# EAGLE design blinds_v60 (EAGLE 7.7.0)

## Sheet 1 of 5
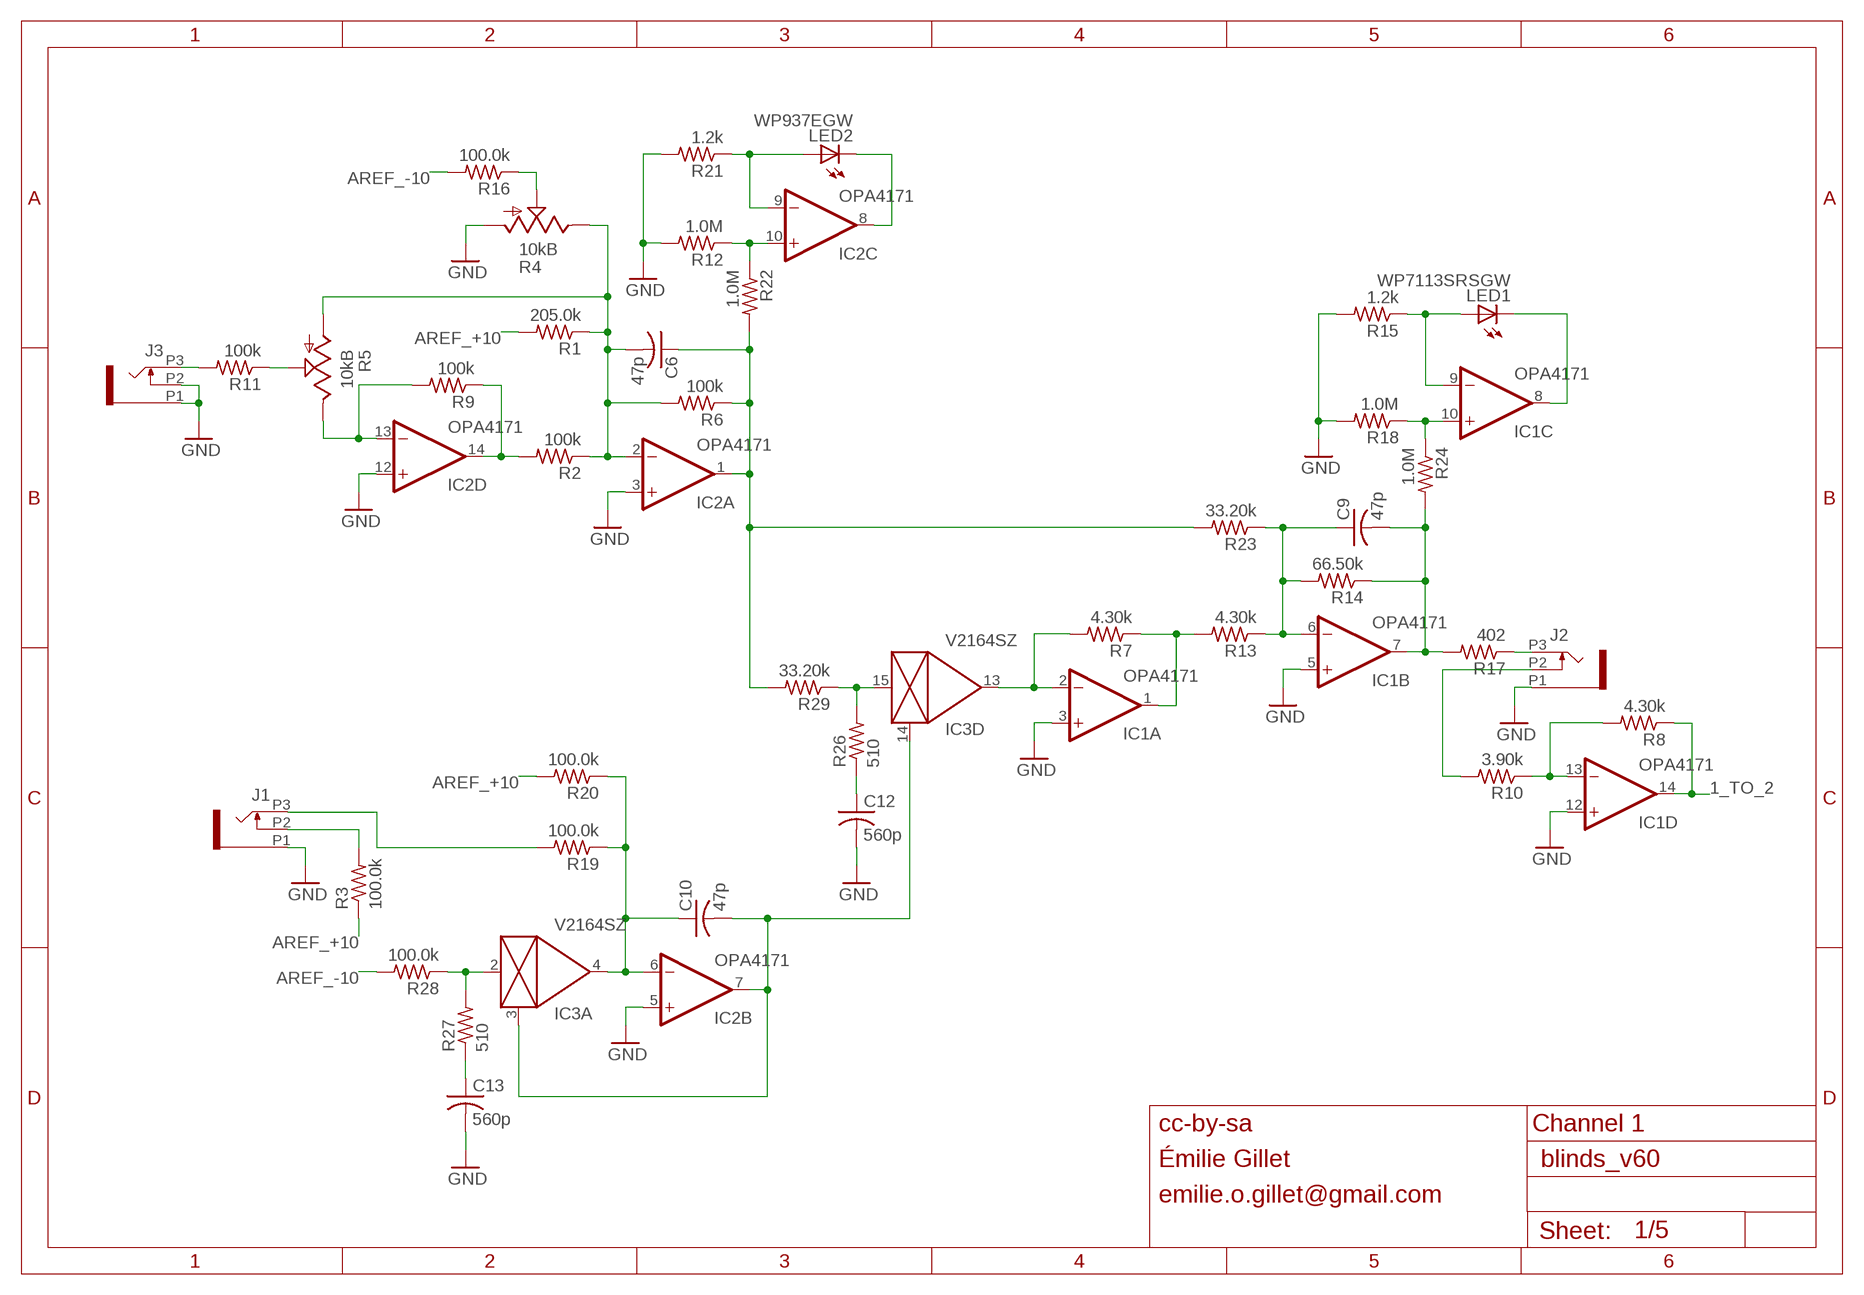
[diagram p0: schematic, sheet 1]

### Parts
C6  47p  C-USC0603  [C0603]
C9  47p  C-USC0603  [C0603]
C10  47p  C-USC0603  [C0603]
C12  560p  C-USC0603  [C0603]
C13  560p  C-USC0603  [C0603]
IC1  OPA4171  TL074PW  [TSSOP14]
IC2  OPA4171  TL074PW  [TSSOP14]
IC3  V2164SZ  SSM2164S  [SOIC16N]
J1  PJ301_THONKICONN6  [WQP_PJ_301M6]
J2  PJ301_THONKICONN6  [WQP_PJ_301M6]
J3  PJ301_THONKICONN6  [WQP_PJ_301M6]
LED1  WP7113SRSGW  LED5MM  [LED5MM]
LED2  WP937EGW  LED3MM  [LED3MM]
R1  205.0k  R-US_R0603  [R0603]
R2  100k  R-US_R0603  [R0603]
R3  100.0k  R-US_R0603  [R0603]
R4  10kB  POT_USVERTICAL_PS  [ALPS_POT_VERTICAL_PS]
R5  10kB  POT_USVERTICAL  [ALPS_POT_VERTICAL]
R6  100k  R-US_R0603  [R0603]
R7  4.30k  R-US_R0603  [R0603]
R8  4.30k  R-US_R0603  [R0603]
R9  100k  R-US_R0603  [R0603]
R10  3.90k  R-US_R0603  [R0603]
R11  100k  R-US_R0603  [R0603]
R12  1.0M  R-US_R0603  [R0603]
R13  4.30k  R-US_R0603  [R0603]
R14  66.50k  R-US_R0603  [R0603]
R15  1.2k  R-US_R0603  [R0603]
R16  100.0k  R-US_R0603  [R0603]
R17  402  R-US_R0603  [R0603]
R18  1.0M  R-US_R0603  [R0603]
R19  100.0k  R-US_R0603  [R0603]
R20  100.0k  R-US_R0603  [R0603]
R21  1.2k  R-US_R0603  [R0603]
R22  1.0M  R-US_R0603  [R0603]
R23  33.20k  R-US_R0603  [R0603]
R24  1.0M  R-US_R0603  [R0603]
R26  510  R-US_R0603  [R0603]
R27  510  R-US_R0603  [R0603]
R28  100.0k  R-US_R0603  [R0603]
R29  33.20k  R-US_R0603  [R0603]

### Nets
1_TO_2: IC1.14(D:OUT) R8.1 ; also sheet 2
AREF_+10: R1.2 R3.1 R20.2 ; also sheet 2,3,4,5
AREF_-10: R16.2 R28.2 ; also sheet 2,3,4,5
CV_IN_1: J3.P3 R11.2
FOO: IC3.2(A:IN) R27.2 R28.1
GAIN_1: C6.1 IC2.1(A:OUT) R6.1 R22.2 R23.2 R29.2
GND: C12.2 C13.2 IC1.3(A:+IN) IC1.5(B:+IN) IC1.12(D:+IN) IC2.3(A:+IN) IC2.5(B:+IN) IC2.12(D:+IN) J1.P1 J2.P1 J3.P1 J3.P2 R4.P$3(A) R12.2 R15.2 R18.2 R21.2 ; also sheet 2,3,4,5
N$2: R4.P$2(S) R16.1
N$3: IC1.2(A:-IN) IC3.13(D:OUT) R7.2
N$4: IC2.8(C:OUT) LED2.K(C)
N$5: IC2.13(D:-IN) R5.P$1(E) R9.2
N$7: J2.P3 R17.1
N$8: IC2.14(D:OUT) R2.2 R9.1
N$9: C6.2 IC2.2(A:-IN) R1.1 R2.1 R4.P$1(E) R5.P$3(A) R6.2
N$10: C9.1 IC1.6(B:-IN) R13.1 R14.2 R23.1
N$14: R5.P$2(S) R11.1
N$15: IC2.9(C:-IN) LED2.A R21.1
N$18: IC1.8(C:OUT) LED1.K(C)
N$19: IC1.9(C:-IN) LED1.A R15.1
N$20: C13.1 R27.1
N$21: J1.P3 R19.2
N$22: IC1.13(D:-IN) R8.2 R10.1
N$25: J2.P2 R10.2
N$47: C12.1 R26.1
N$54: J1.P2 R3.2
N$64: IC1.1(A:OUT) R7.1 R13.2
N$65: C10.1 IC2.6(B:-IN) IC3.4(A:OUT) R19.1 R20.1
N$66: C10.2 IC2.7(B:OUT) IC3.3(A:CTRL) IC3.14(D:CTRL)
N$75: IC3.15(D:IN) R26.2 R29.1
N$96: IC1.10(C:+IN) R18.1 R24.1
N$99: IC2.10(C:+IN) R12.1 R22.1
OUT1: C9.2 IC1.7(B:OUT) R14.1 R17.2 R24.2

### Notes on the sheet
- cc-by-sa | Channel 1
- Émilie Gillet
- emilie.o.gillet@gmail.com

## Sheet 2 of 5
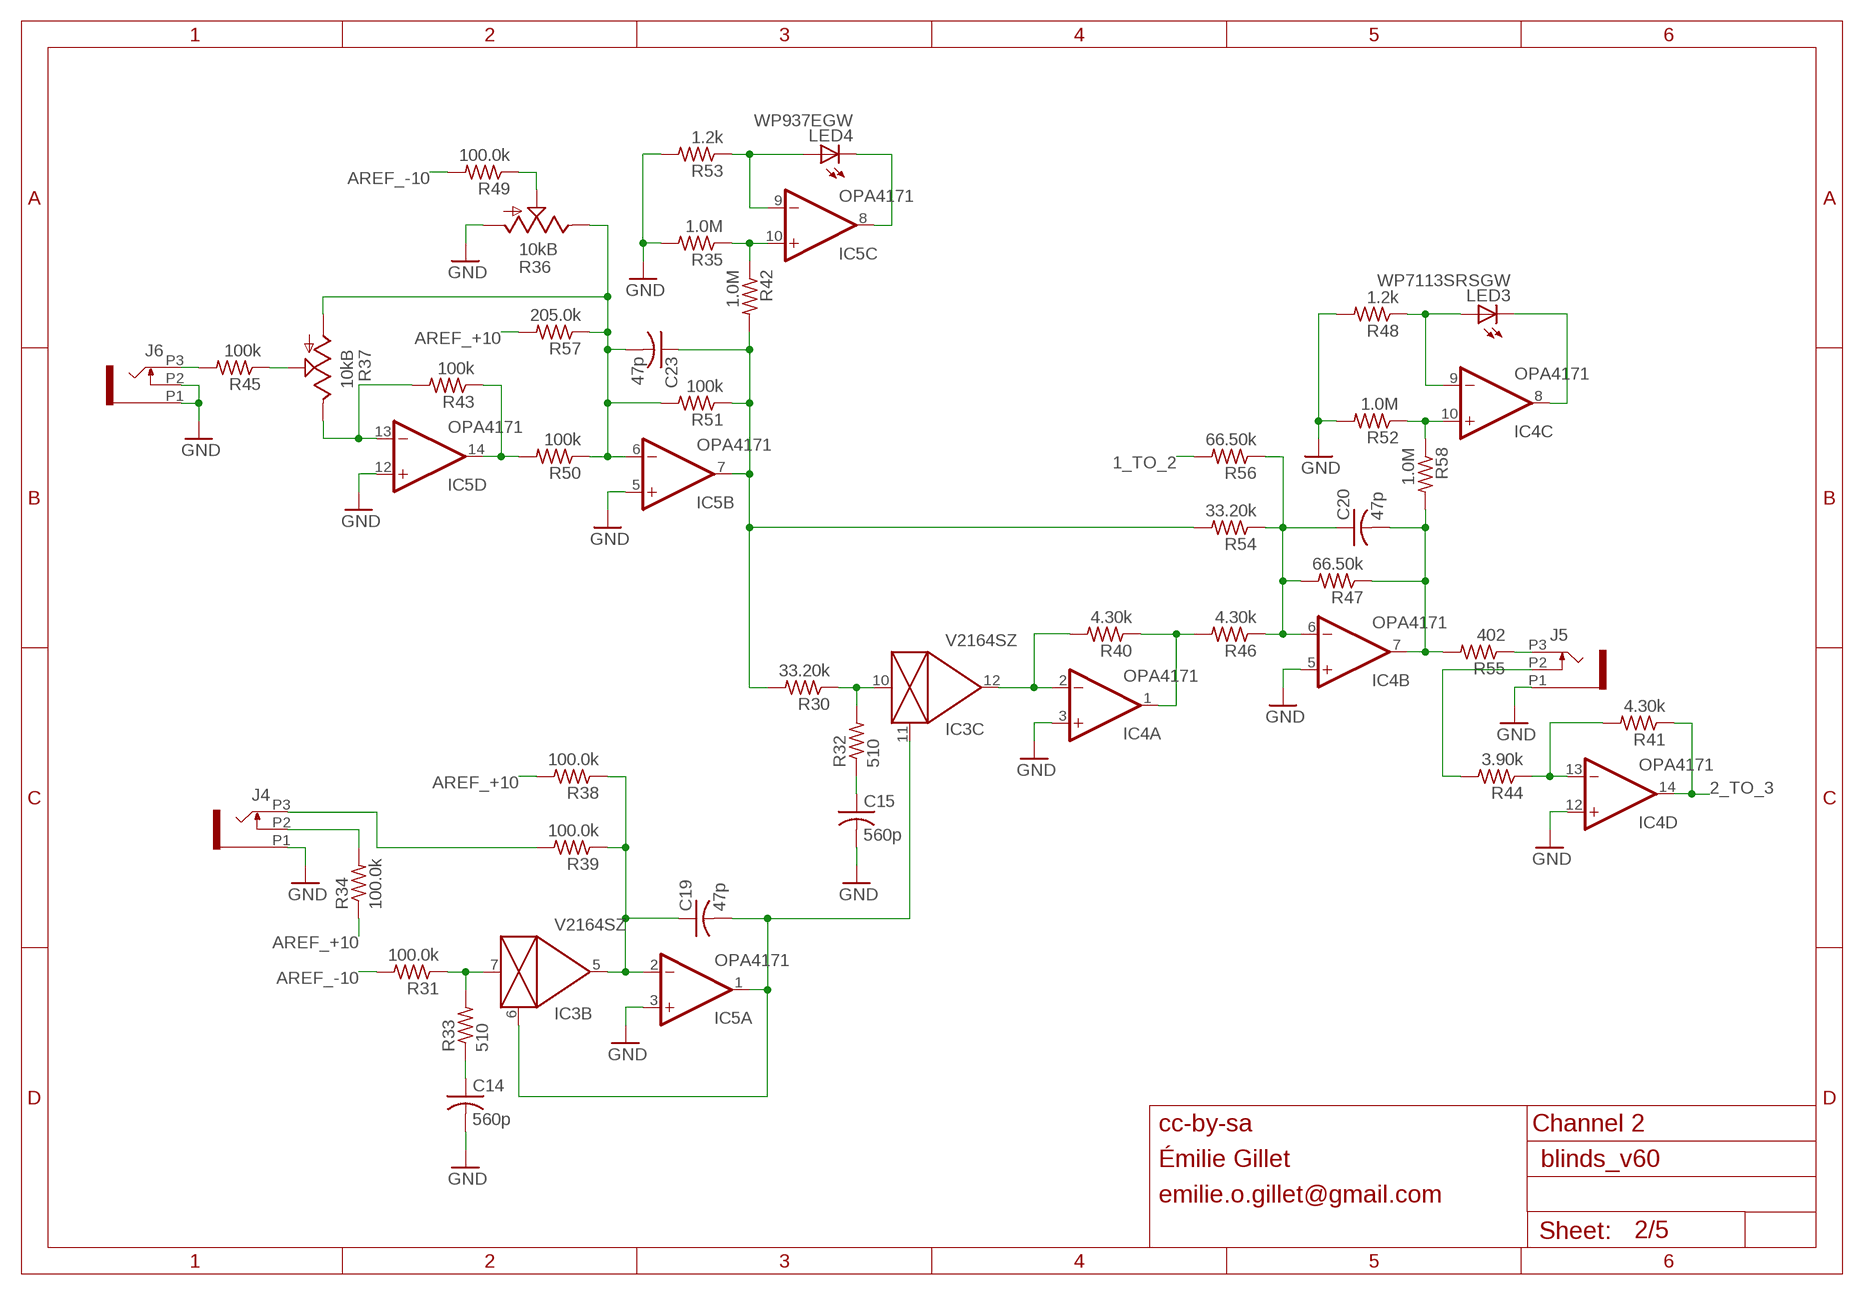
[diagram p1: schematic, sheet 2]

### Parts
C14  560p  C-USC0603  [C0603]
C15  560p  C-USC0603  [C0603]
C19  47p  C-USC0603  [C0603]
C20  47p  C-USC0603  [C0603]
C23  47p  C-USC0603  [C0603]
IC4  OPA4171  TL074PW  [TSSOP14]
IC5  OPA4171  TL074PW  [TSSOP14]
J4  PJ301_THONKICONN6  [WQP_PJ_301M6]
J5  PJ301_THONKICONN6  [WQP_PJ_301M6]
J6  PJ301_THONKICONN6  [WQP_PJ_301M6]
LED3  WP7113SRSGW  LED5MM  [LED5MM]
LED4  WP937EGW  LED3MM  [LED3MM]
R30  33.20k  R-US_R0603  [R0603]
R31  100.0k  R-US_R0603  [R0603]
R32  510  R-US_R0603  [R0603]
R33  510  R-US_R0603  [R0603]
R34  100.0k  R-US_R0603  [R0603]
R35  1.0M  R-US_R0603  [R0603]
R36  10kB  POT_USVERTICAL_PS  [ALPS_POT_VERTICAL_PS]
R37  10kB  POT_USVERTICAL  [ALPS_POT_VERTICAL]
R38  100.0k  R-US_R0603  [R0603]
R39  100.0k  R-US_R0603  [R0603]
R40  4.30k  R-US_R0603  [R0603]
R41  4.30k  R-US_R0603  [R0603]
R42  1.0M  R-US_R0603  [R0603]
R43  100k  R-US_R0603  [R0603]
R44  3.90k  R-US_R0603  [R0603]
R45  100k  R-US_R0603  [R0603]
R46  4.30k  R-US_R0603  [R0603]
R47  66.50k  R-US_R0603  [R0603]
R48  1.2k  R-US_R0603  [R0603]
R49  100.0k  R-US_R0603  [R0603]
R50  100k  R-US_R0603  [R0603]
R51  100k  R-US_R0603  [R0603]
R52  1.0M  R-US_R0603  [R0603]
R53  1.2k  R-US_R0603  [R0603]
R54  33.20k  R-US_R0603  [R0603]
R55  402  R-US_R0603  [R0603]
R56  66.50k  R-US_R0603  [R0603]
R57  205.0k  R-US_R0603  [R0603]
R58  1.0M  R-US_R0603  [R0603]

### Nets
1_TO_2: R56.2 ; also sheet 1
2_TO_3: IC4.14(D:OUT) R41.1 ; also sheet 3
AREF_+10: R34.1 R38.2 R57.2 ; also sheet 1,3,4,5
AREF_-10: R31.2 R49.2 ; also sheet 1,3,4,5
FOO1: IC3.7(B:IN) R31.1 R33.2
GAIN_2: C23.1 IC5.7(B:OUT) R30.2 R42.2 R51.1 R54.2
GND: C14.2 C15.2 IC4.3(A:+IN) IC4.5(B:+IN) IC4.12(D:+IN) IC5.3(A:+IN) IC5.5(B:+IN) IC5.12(D:+IN) J4.P1 J5.P1 J6.P1 J6.P2 R35.2 R36.P$3(A) R48.2 R52.2 R53.2 ; also sheet 1,3,4,5
N$6: J5.P3 R55.1
N$17: C15.1 R32.1
N$24: IC3.10(C:IN) R30.1 R32.2
N$26: IC3.12(C:OUT) IC4.2(A:-IN) R40.2
N$27: C20.1 IC4.6(B:-IN) R46.1 R47.2 R54.1 R56.1
N$28: J6.P3 R45.2
N$29: IC5.13(D:-IN) R37.P$1(E) R43.2
N$30: IC5.14(D:OUT) R43.1 R50.2
N$31: C23.2 IC5.6(B:-IN) R36.P$1(E) R37.P$3(A) R50.1 R51.2 R57.1
N$32: R36.P$2(S) R49.1
N$33: IC5.8(C:OUT) LED4.K(C)
N$34: IC5.9(C:-IN) LED4.A R53.1
N$35: IC4.8(C:OUT) LED3.K(C)
N$36: IC4.9(C:-IN) LED3.A R48.1
N$37: IC4.13(D:-IN) R41.2 R44.1
N$38: J5.P2 R44.2
N$39: IC4.1(A:OUT) R40.1 R46.2
N$40: R37.P$2(S) R45.1
N$41: C14.1 R33.1
N$42: C19.1 IC3.5(B:OUT) IC5.2(A:-IN) R38.1 R39.1
N$43: C19.2 IC3.6(B:CTRL) IC3.11(C:CTRL) IC5.1(A:OUT)
N$44: J4.P3 R39.2
N$87: J4.P2 R34.2
N$97: IC4.10(C:+IN) R52.1 R58.1
N$103: IC5.10(C:+IN) R35.1 R42.1
OUT2: C20.2 IC4.7(B:OUT) R47.1 R55.2 R58.2

### Notes on the sheet
- cc-by-sa | Channel 2
- Émilie Gillet
- emilie.o.gillet@gmail.com

## Sheet 3 of 5
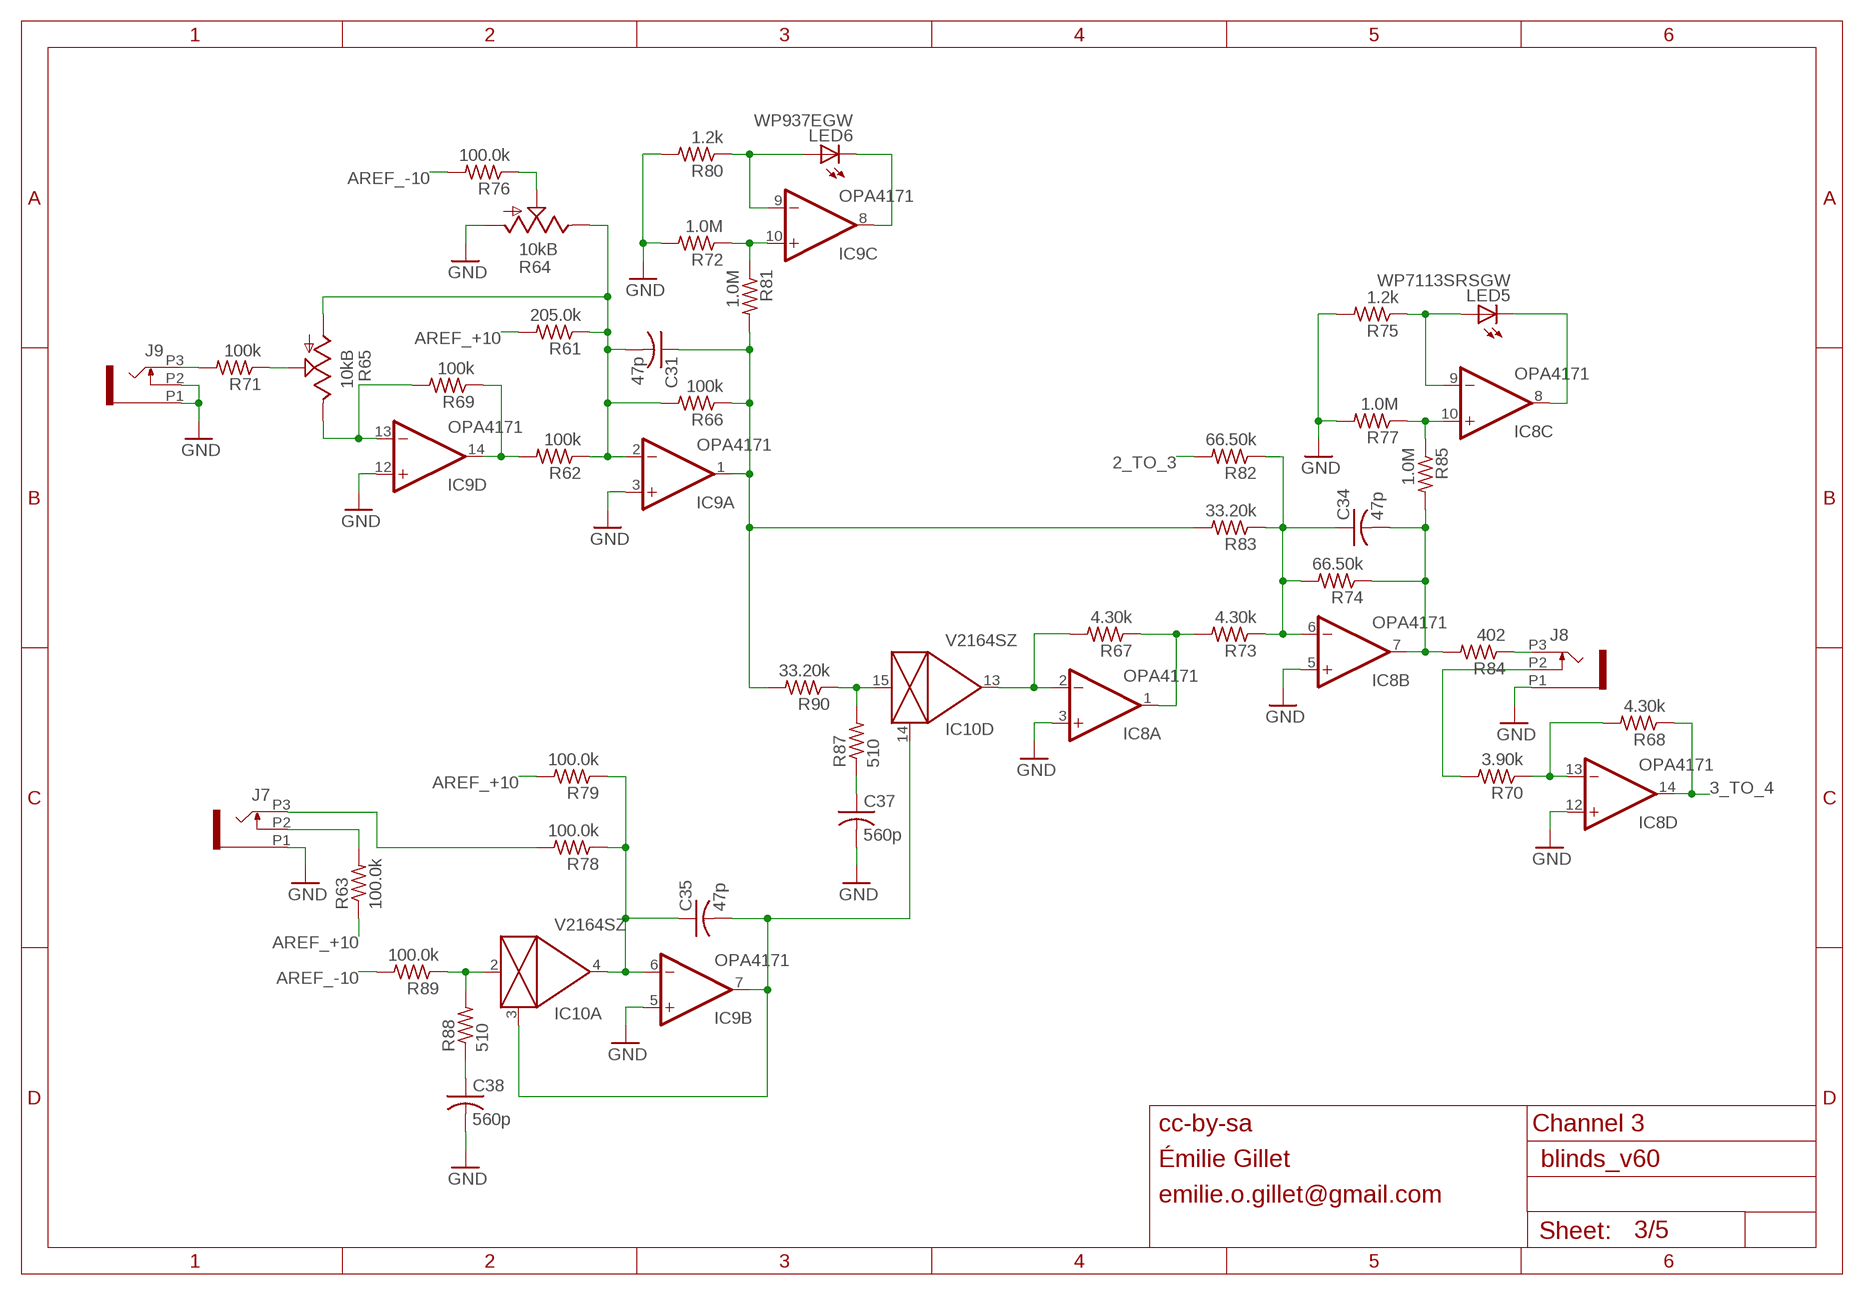
[diagram p2: schematic, sheet 3]

### Parts
C31  47p  C-USC0603  [C0603]
C34  47p  C-USC0603  [C0603]
C35  47p  C-USC0603  [C0603]
C37  560p  C-USC0603  [C0603]
C38  560p  C-USC0603  [C0603]
IC8  OPA4171  TL074PW  [TSSOP14]
IC9  OPA4171  TL074PW  [TSSOP14]
IC10  V2164SZ  SSM2164S  [SOIC16N]
J7  PJ301_THONKICONN6  [WQP_PJ_301M6]
J8  PJ301_THONKICONN6  [WQP_PJ_301M6]
J9  PJ301_THONKICONN6  [WQP_PJ_301M6]
LED5  WP7113SRSGW  LED5MM  [LED5MM]
LED6  WP937EGW  LED3MM  [LED3MM]
R61  205.0k  R-US_R0603  [R0603]
R62  100k  R-US_R0603  [R0603]
R63  100.0k  R-US_R0603  [R0603]
R64  10kB  POT_USVERTICAL_PS  [ALPS_POT_VERTICAL_PS]
R65  10kB  POT_USVERTICAL  [ALPS_POT_VERTICAL]
R66  100k  R-US_R0603  [R0603]
R67  4.30k  R-US_R0603  [R0603]
R68  4.30k  R-US_R0603  [R0603]
R69  100k  R-US_R0603  [R0603]
R70  3.90k  R-US_R0603  [R0603]
R71  100k  R-US_R0603  [R0603]
R72  1.0M  R-US_R0603  [R0603]
R73  4.30k  R-US_R0603  [R0603]
R74  66.50k  R-US_R0603  [R0603]
R75  1.2k  R-US_R0603  [R0603]
R76  100.0k  R-US_R0603  [R0603]
R77  1.0M  R-US_R0603  [R0603]
R78  100.0k  R-US_R0603  [R0603]
R79  100.0k  R-US_R0603  [R0603]
R80  1.2k  R-US_R0603  [R0603]
R81  1.0M  R-US_R0603  [R0603]
R82  66.50k  R-US_R0603  [R0603]
R83  33.20k  R-US_R0603  [R0603]
R84  402  R-US_R0603  [R0603]
R85  1.0M  R-US_R0603  [R0603]
R87  510  R-US_R0603  [R0603]
R88  510  R-US_R0603  [R0603]
R89  100.0k  R-US_R0603  [R0603]
R90  33.20k  R-US_R0603  [R0603]

### Nets
2_TO_3: R82.2 ; also sheet 2
3_TO_4: IC8.14(D:OUT) R68.1 ; also sheet 4
AREF_+10: R61.2 R63.1 R79.2 ; also sheet 1,2,4,5
AREF_-10: R76.2 R89.2 ; also sheet 1,2,4,5
FOO2: IC10.2(A:IN) R88.2 R89.1
GAIN_3: C31.1 IC9.1(A:OUT) R66.1 R81.2 R83.2 R90.2
GND: C37.2 C38.2 IC8.3(A:+IN) IC8.5(B:+IN) IC8.12(D:+IN) IC9.3(A:+IN) IC9.5(B:+IN) IC9.12(D:+IN) J7.P1 J8.P1 J9.P1 J9.P2 R64.P$3(A) R72.2 R75.2 R77.2 R80.2 ; also sheet 1,2,4,5
N$23: J8.P3 R84.1
N$45: C37.1 R87.1
N$46: IC10.15(D:IN) R87.2 R90.1
N$48: IC8.2(A:-IN) IC10.13(D:OUT) R67.2
N$49: C34.1 IC8.6(B:-IN) R73.1 R74.2 R82.1 R83.1
N$50: J9.P3 R71.2
N$51: IC9.13(D:-IN) R65.P$1(E) R69.2
N$52: IC9.14(D:OUT) R62.2 R69.1
N$53: C31.2 IC9.2(A:-IN) R61.1 R62.1 R64.P$1(E) R65.P$3(A) R66.2
N$55: R64.P$2(S) R76.1
N$56: IC9.8(C:OUT) LED6.K(C)
N$57: IC9.9(C:-IN) LED6.A R80.1
N$58: IC8.8(C:OUT) LED5.K(C)
N$59: IC8.9(C:-IN) LED5.A R75.1
N$60: IC8.13(D:-IN) R68.2 R70.1
N$61: J8.P2 R70.2
N$62: IC8.1(A:OUT) R67.1 R73.2
N$63: C38.1 R88.1
N$67: C35.1 IC9.6(B:-IN) IC10.4(A:OUT) R78.1 R79.1
N$68: C35.2 IC9.7(B:OUT) IC10.3(A:CTRL) IC10.14(D:CTRL)
N$70: R65.P$2(S) R71.1
N$93: J7.P3 R78.2
N$94: J7.P2 R63.2
N$98: IC8.10(C:+IN) R77.1 R85.1
N$102: IC9.10(C:+IN) R72.1 R81.1
OUT3: C34.2 IC8.7(B:OUT) R74.1 R84.2 R85.2

### Notes on the sheet
- cc-by-sa | Channel 3
- Émilie Gillet
- emilie.o.gillet@gmail.com

## Sheet 4 of 5
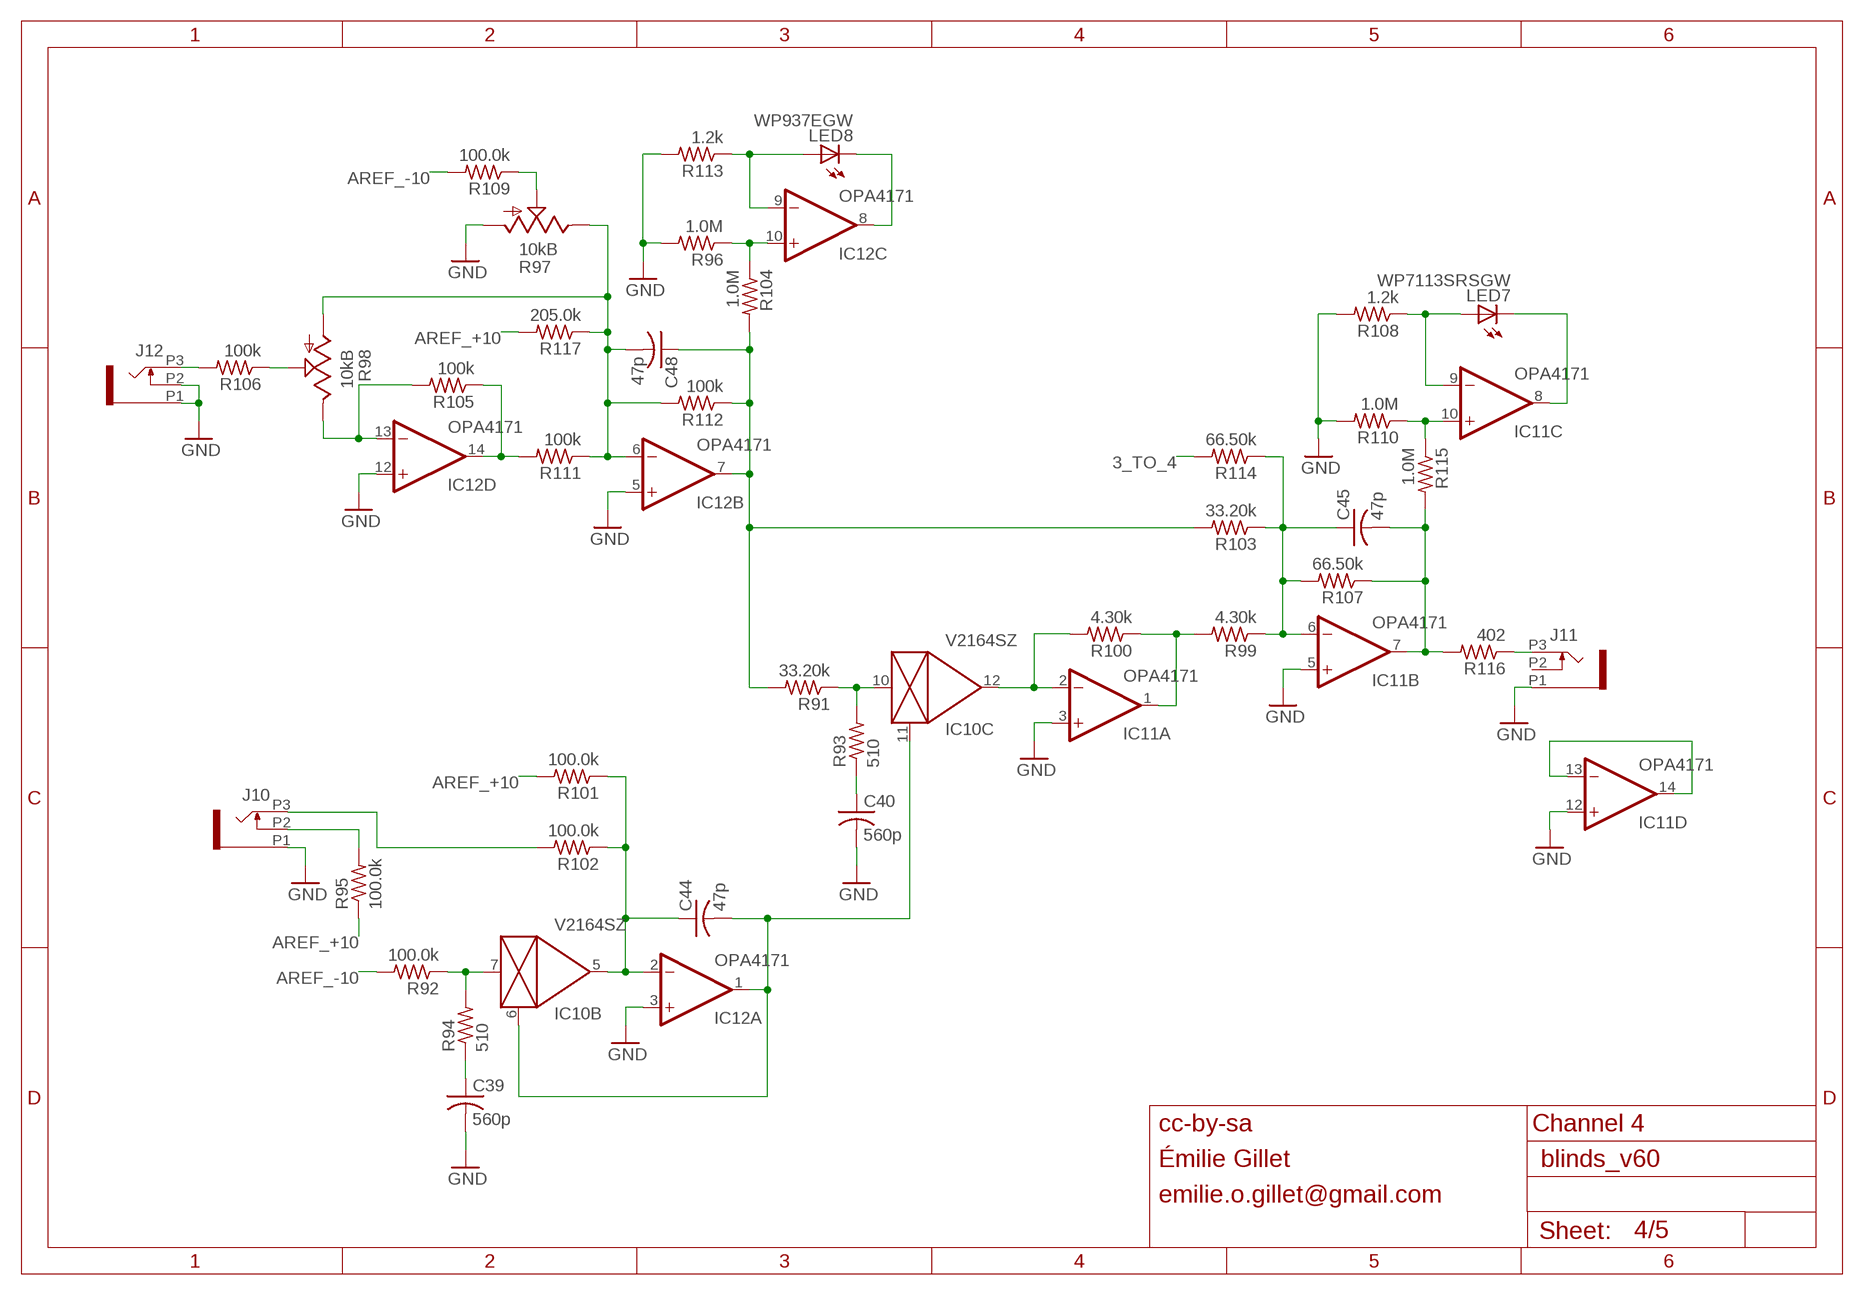
[diagram p3: schematic, sheet 4]

### Parts
C39  560p  C-USC0603  [C0603]
C40  560p  C-USC0603  [C0603]
C44  47p  C-USC0603  [C0603]
C45  47p  C-USC0603  [C0603]
C48  47p  C-USC0603  [C0603]
IC11  OPA4171  TL074PW  [TSSOP14]
IC12  OPA4171  TL074PW  [TSSOP14]
J10  PJ301_THONKICONN6  [WQP_PJ_301M6]
J11  PJ301_THONKICONN6  [WQP_PJ_301M6]
J12  PJ301_THONKICONN6  [WQP_PJ_301M6]
LED7  WP7113SRSGW  LED5MM  [LED5MM]
LED8  WP937EGW  LED3MM  [LED3MM]
R91  33.20k  R-US_R0603  [R0603]
R92  100.0k  R-US_R0603  [R0603]
R93  510  R-US_R0603  [R0603]
R94  510  R-US_R0603  [R0603]
R95  100.0k  R-US_R0603  [R0603]
R96  1.0M  R-US_R0603  [R0603]
R97  10kB  POT_USVERTICAL_PS  [ALPS_POT_VERTICAL_PS]
R98  10kB  POT_USVERTICAL  [ALPS_POT_VERTICAL]
R99  4.30k  R-US_R0603  [R0603]
R100  4.30k  R-US_R0603  [R0603]
R101  100.0k  R-US_R0603  [R0603]
R102  100.0k  R-US_R0603  [R0603]
R103  33.20k  R-US_R0603  [R0603]
R104  1.0M  R-US_R0603  [R0603]
R105  100k  R-US_R0603  [R0603]
R106  100k  R-US_R0603  [R0603]
R107  66.50k  R-US_R0603  [R0603]
R108  1.2k  R-US_R0603  [R0603]
R109  100.0k  R-US_R0603  [R0603]
R110  1.0M  R-US_R0603  [R0603]
R111  100k  R-US_R0603  [R0603]
R112  100k  R-US_R0603  [R0603]
R113  1.2k  R-US_R0603  [R0603]
R114  66.50k  R-US_R0603  [R0603]
R115  1.0M  R-US_R0603  [R0603]
R116  402  R-US_R0603  [R0603]
R117  205.0k  R-US_R0603  [R0603]

### Nets
3_TO_4: R114.2 ; also sheet 3
AREF_+5: IC11.13(D:-IN) IC11.14(D:OUT)
AREF_+10: R95.1 R101.2 R117.2 ; also sheet 1,2,3,5
AREF_-10: R92.2 R109.2 ; also sheet 1,2,3,5
FOO3: IC10.7(B:IN) R92.1 R94.2
GAIN_4: C48.1 IC12.7(B:OUT) R91.2 R103.2 R104.2 R112.1
GND: C39.2 C40.2 IC11.3(A:+IN) IC11.5(B:+IN) IC11.12(D:+IN) IC12.3(A:+IN) IC12.5(B:+IN) IC12.12(D:+IN) J10.P1 J11.P1 J12.P1 J12.P2 R96.2 R97.P$3(A) R108.2 R110.2 R113.2 ; also sheet 1,2,3,5
N$69: J10.P3 R102.2
N$71: J11.P3 R116.1
N$72: C40.1 R93.1
N$73: IC10.10(C:IN) R91.1 R93.2
N$74: IC10.12(C:OUT) IC11.2(A:-IN) R100.2
N$76: C45.1 IC11.6(B:-IN) R99.1 R103.1 R107.2 R114.1
N$77: J12.P3 R106.2
N$78: IC12.13(D:-IN) R98.P$1(E) R105.2
N$79: IC12.14(D:OUT) R105.1 R111.2
N$80: C48.2 IC12.6(B:-IN) R97.P$1(E) R98.P$3(A) R111.1 R112.2 R117.1
N$81: R97.P$2(S) R109.1
N$82: IC12.8(C:OUT) LED8.K(C)
N$83: IC12.9(C:-IN) LED8.A R113.1
N$84: IC11.8(C:OUT) LED7.K(C)
N$85: IC11.9(C:-IN) LED7.A R108.1
N$88: IC11.1(A:OUT) R99.2 R100.1
N$89: R98.P$2(S) R106.1
N$90: C39.1 R94.1
N$91: C44.1 IC10.5(B:OUT) IC12.2(A:-IN) R101.1 R102.1
N$92: C44.2 IC10.6(B:CTRL) IC10.11(C:CTRL) IC12.1(A:OUT)
N$95: J10.P2 R95.2
N$100: IC11.10(C:+IN) R110.1 R115.1
N$101: IC12.10(C:+IN) R96.1 R104.1
OUT4: C45.2 IC11.7(B:OUT) R107.1 R115.2 R116.2
Unconnected: J11.P2

### Notes on the sheet
- cc-by-sa | Channel 4
- Émilie Gillet
- emilie.o.gillet@gmail.com

## Sheet 5 of 5
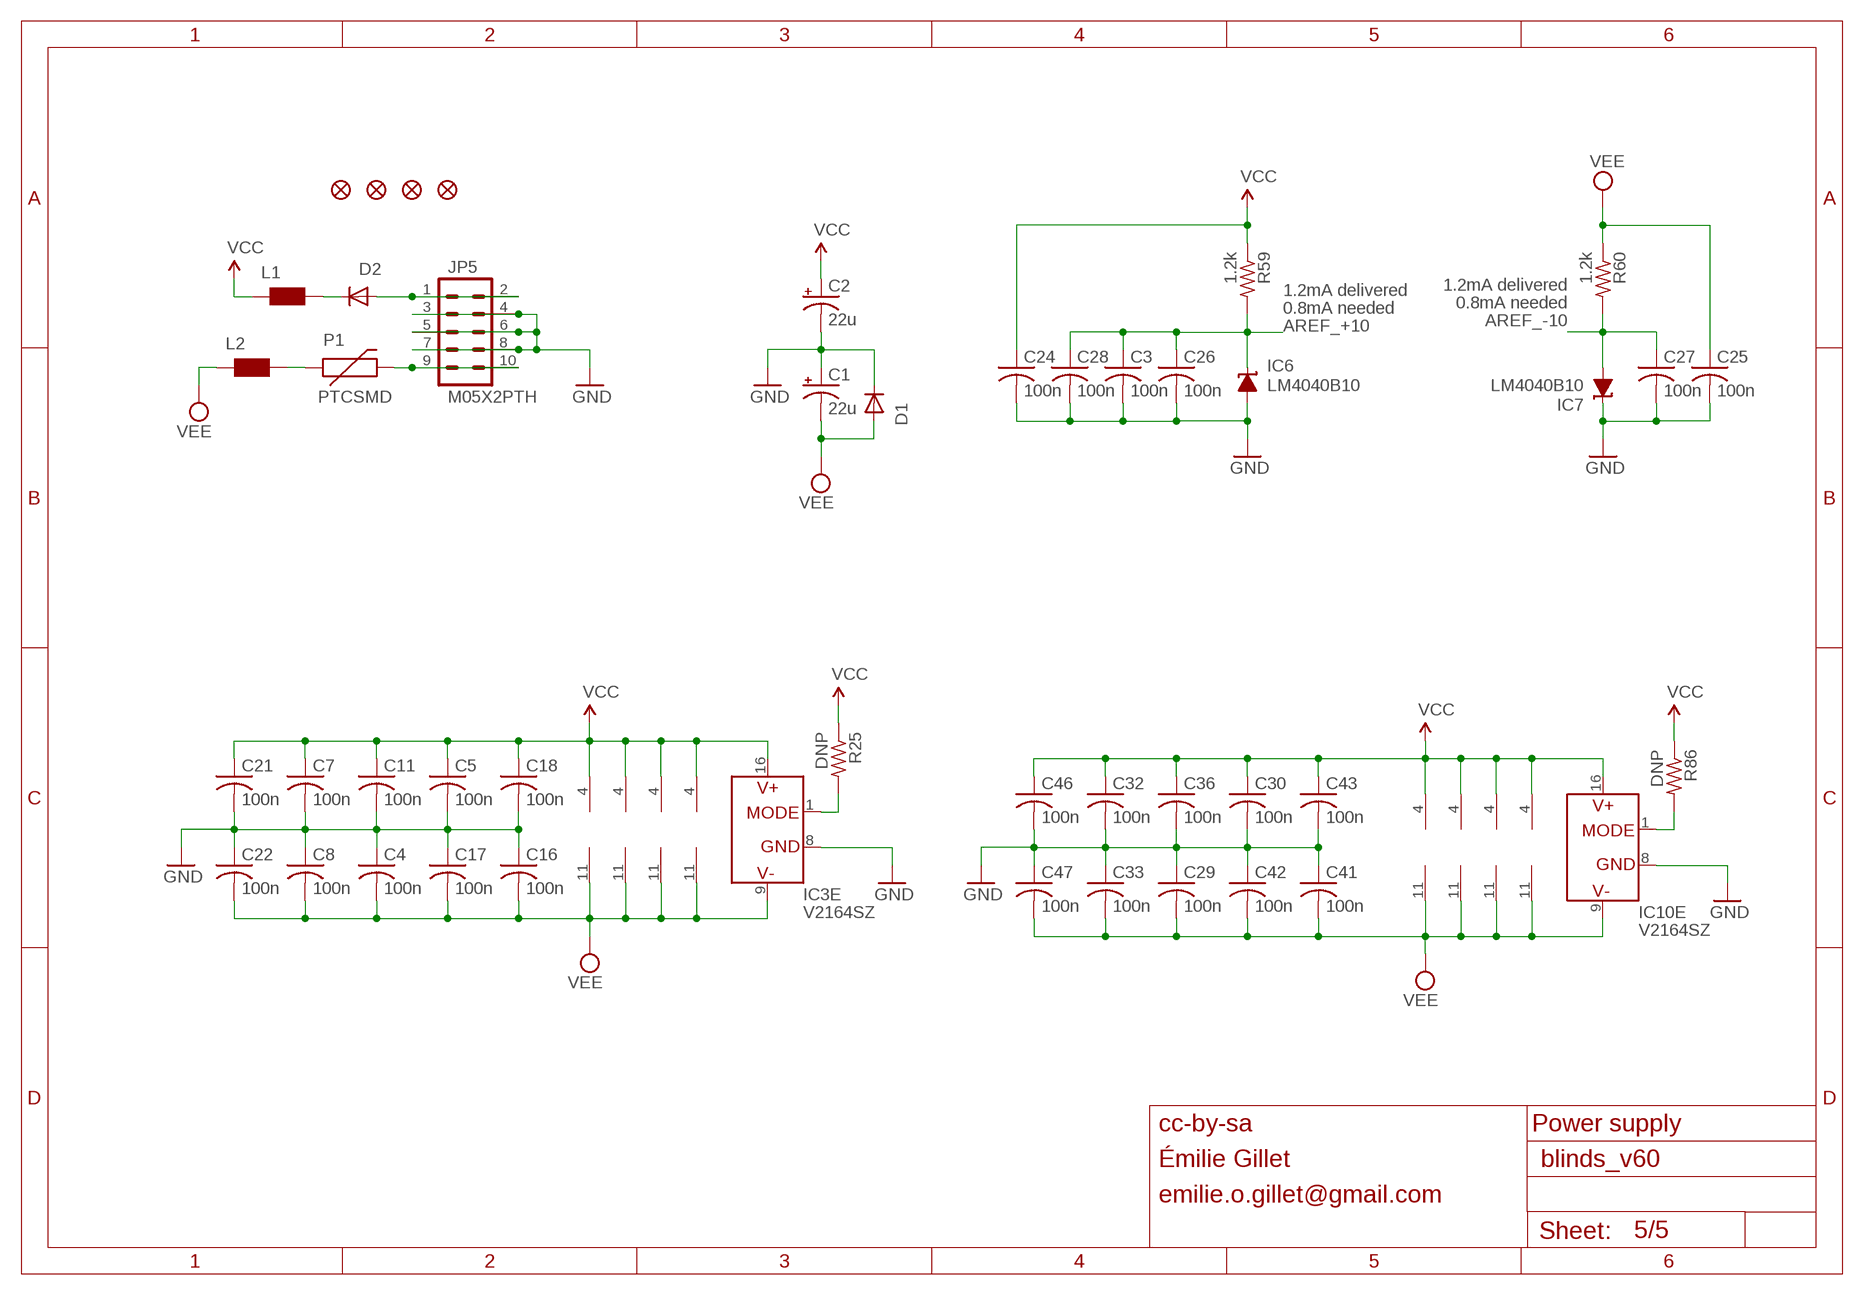
[diagram p4: schematic, sheet 5]

### Parts
C1  22u  CPOL-USC  [PANASONIC_C]
C2  22u  CPOL-USC  [PANASONIC_C]
C3  100n  C-USC0603  [C0603]
C4  100n  C-USC0603  [C0603]
C5  100n  C-USC0603  [C0603]
C7  100n  C-USC0603  [C0603]
C8  100n  C-USC0603  [C0603]
C11  100n  C-USC0603  [C0603]
C16  100n  C-USC0603  [C0603]
C17  100n  C-USC0603  [C0603]
C18  100n  C-USC0603  [C0603]
C21  100n  C-USC0603  [C0603]
C22  100n  C-USC0603  [C0603]
C24  100n  C-USC0603  [C0603]
C25  100n  C-USC0603  [C0603]
C26  100n  C-USC0603  [C0603]
C27  100n  C-USC0603  [C0603]
C28  100n  C-USC0603  [C0603]
C29  100n  C-USC0603  [C0603]
C30  100n  C-USC0603  [C0603]
C32  100n  C-USC0603  [C0603]
C33  100n  C-USC0603  [C0603]
C36  100n  C-USC0603  [C0603]
C41  100n  C-USC0603  [C0603]
C42  100n  C-USC0603  [C0603]
C43  100n  C-USC0603  [C0603]
C46  100n  C-USC0603  [C0603]
C47  100n  C-USC0603  [C0603]
D1  1N5819HW  DIODE-SOD123  [SOD123]
D2  1N5819HW  DIODE-SOD123  [SOD123]
IC6  LM4040B10  LM4041B12DBZ  [DBZ_R-PDSO-G3]
IC7  LM4040B10  LM4041B12DBZ  [DBZ_R-PDSO-G3]
JP1  FIDUCIAL1X2  [FIDUCIAL-1X2]
JP2  FIDUCIAL1X2  [FIDUCIAL-1X2]
JP3  FIDUCIAL1X2  [FIDUCIAL-1X2]
JP4  FIDUCIAL1X2  [FIDUCIAL-1X2]
JP5  M05X2PTH  [AVR_ICSP]
L1  WE-CBF_0603  [0603]
L2  WE-CBF_0603  [0603]
P1  PTCSMD  [PTC-1206]
R25  DNP  R-US_R0603  [R0603]
R59  1.2k  R-US_R0603  [R0603]
R60  1.2k  R-US_R0603  [R0603]
R86  DNP  R-US_R0603  [R0603]

### Nets
AREF_+10: C3.1 C26.1 C28.1 IC6.1(C) R59.2 ; also sheet 1,2,3,4
AREF_-10: C27.1 IC7.2(A) R60.2 ; also sheet 1,2,3,4
GND: C1.+ C2.- C3.2 C4.1 C5.2 C7.2 C8.1 C11.2 C16.1 C17.1 C18.2 C21.2 C22.1 C24.2 C25.2 C26.2 C27.2 C28.2 C29.1 C30.2 C32.2 C33.1 C36.2 C41.1 C42.1 C43.2 C46.2 C47.1 D1.C IC3.8(E:GND) IC6.2(A) IC7.1(C) IC10.8(E:GND) JP5.3 JP5.4 JP5.5 JP5.6 JP5.7 JP5.8 ; also sheet 1,2,3,4
N$1: IC3.1(E:MODE) R25.2
N$11: D2.A JP5.1 JP5.2
N$12: JP5.9 JP5.10 P1.2
N$13: L2.2 P1.1
N$16: D2.C L1.2
N$86: IC10.1(E:MODE) R86.2
VCC: C2.+ C5.1 C7.1 C11.1 C18.1 C21.1 C24.1 C30.1 C32.1 C36.1 C43.1 C46.1 IC1.4(P:V+) IC2.4(P:V+) IC3.16(E:V+) IC4.4(P:V+) IC5.4(P:V+) IC8.4(P:V+) IC9.4(P:V+) IC10.16(E:V+) IC11.4(P:V+) IC12.4(P:V+) L1.1 R25.1 R59.1 R86.1
VEE: C1.- C4.2 C8.2 C16.2 C17.2 C22.2 C25.1 C29.2 C33.2 C41.2 C42.2 C47.2 D1.A IC1.11(P:V-) IC2.11(P:V-) IC3.9(E:V-) IC4.11(P:V-) IC5.11(P:V-) IC8.11(P:V-) IC9.11(P:V-) IC10.9(E:V-) IC11.11(P:V-) IC12.11(P:V-) L2.1 R60.1

### Notes on the sheet
- 1.2mA delivered
- 1.2mA delivered | 0.8mA needed
- 0.8mA needed
- cc-by-sa | Power supply
- Émilie Gillet
- emilie.o.gillet@gmail.com

## Library data of the parts
C1 C2 = rcl:CPOL-US: POLARIZED CAPACITOR, American symbol
C3-C48 = rcl:C-US: CAPACITOR, American symbol
D1 D2 = diode:DIODE-: DIODE
IC1 IC2 IC4 IC5 IC8 IC9 IC11 IC12 = linear:TL074: OP AMP
IC3 IC10 = ssm2164:SSM2164
IC6 IC7 = texas:LM4041: PRECISION MICROPOWER SHUNT VOLTAGE REFERENCE Source: http://focus.ti.com/lit/ds/slcs146e/slcs146e.pdf
J1-J12 = og-pj301:PJ301_THONKICONN
JP1-JP4 = SparkFun:FIDUCIAL: Fiducial Alignment Points Various fiducial points for machine vision alignment.
JP5 = og-header:M05X2: Header 5x2 Standard 10-pin dual row 0.1" header. Commonly used with AVR-ISP. Use with Spark Fun Electronics SKU: PRT-00778
L1 L2 = wuerth-elektronik:WE-CBF: SMD EMI Suppression Ferrite Beads - excellent anti-EMI properties - low DCR - impedances till 3000 ohms - rated current up to 6 A
LED1-LED8 = led:LED: LED OSRAM: - CHIPLED LG R971, LG N971, LY N971, LG Q971, LY Q971, LO R971, LY R971 LH N974, LH R974 LS Q976, LO Q976, LY Q976 LO Q996 - Hyper CHIPLED LW Q18S LB Q993, LB Q99A, LB R99A - SideLED LS A670, LO A670, LY A670, LG A670, LP A670 LB A673, LV A673, LT A673, LW A673 LH A674 LY A675 LS A676, LA A676, LO A676, LY A676, LW A676 LS A679, LY A679, LG A679 - Hyper Micro SIDELED® LS Y876, LA Y876, LO Y876, LY Y876 LT Y87S - SmartLED LW L88C, LW L88S LB L89C, LB L89S, LG L890 LS L89K, LO L89K, LY L89K LS L896, LA L896, LO L896, LY L896 - TOPLED LS T670, LO T670, LY T670, LG T670, LP T670 LSG T670, LSP T670, LSY T670, LOP T670, LYG T670 LG T671, LOG T671, LSG T671 LB T673, LV T673, LT T673, LW T673 LH T674 LS T676, LA T676, LO T676, LY T676, LB T676, LH T676, LSB T676, LW T676 LB T67C, LV T67C, LT T67C, LS T67K, LO T67K, LY T67K, LW E67C LS E67B, LA E67B, LO E67B, LY E67B, LB E67C, LV E67C, LT E67C LW T67C LS T679, LY T679, LG T679 LS T770, LO T770, LY T770, LG T770, LP T770 LB T773, LV T773, LT T773, LW T773 LH T774 LS E675, LA E675, LY E675, LS T675 LS T776, LA T776, LO T776, LY T776, LB T776 LHGB T686 LT T68C, LB T68C - Hyper Mini TOPLED® LB M676 - Mini TOPLED Santana® LG M470 LS M47K, LO M47K, LY M47K Source: http://www.osram.convergy.de LUXEON: - LUMILED® LXK2-PW12-R00, LXK2-PW12-S00, LXK2-PW14-U00, LXK2-PW14-V00 LXK2-PM12-R00, LXK2-PM12-S00, LXK2-PM14-U00 LXK2-PE12-Q00, LXK2-PE12-R00, LXK2-PE12-S00, LXK2-PE14-T00, LXK2-PE14-U00 LXK2-PB12-K00, LXK2-PB12-L00, LXK2-PB12-M00, LXK2-PB14-N00, LXK2-PB14-P00, LXK2-PB14-Q00 LXK2-PR12-L00, LXK2-PR12-M00, LXK2-PR14-Q00, LXK2-PR14-R00 LXK2-PD12-Q00, LXK2-PD12-R00, LXK2-PD12-S00 LXK2-PH12-R00, LXK2-PH12-S00 LXK2-PL12-P00, LXK2-PL12-Q00, LXK2-PL12-R00 Source: www.luxeon.com KINGBRIGHT: KA-3528ASYC Source: www.kingbright.com
P1 = SparkFun:PTC: Resettable Fuse PTC Resettable Fuse. Spark Fun Electronics SKU : COM-08357
R1-R3 R6-R35 R38-R63 R66-R96 R99-R117 = rcl:R-US_: RESISTOR, American symbol
R4 R5 R36 R37 R64 R65 R97 R98 = pot-alps:POT_US

## Board
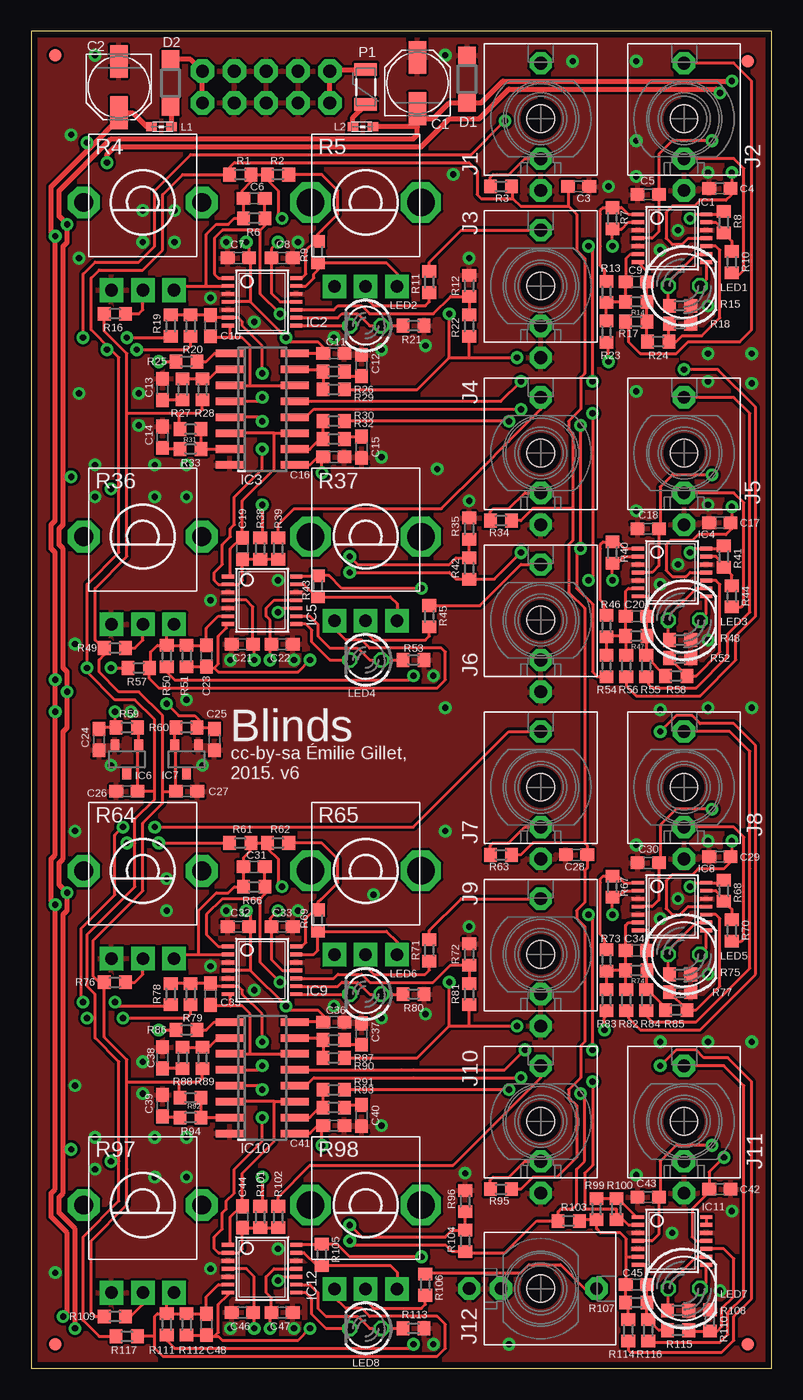
[diagram p5: board, top side]
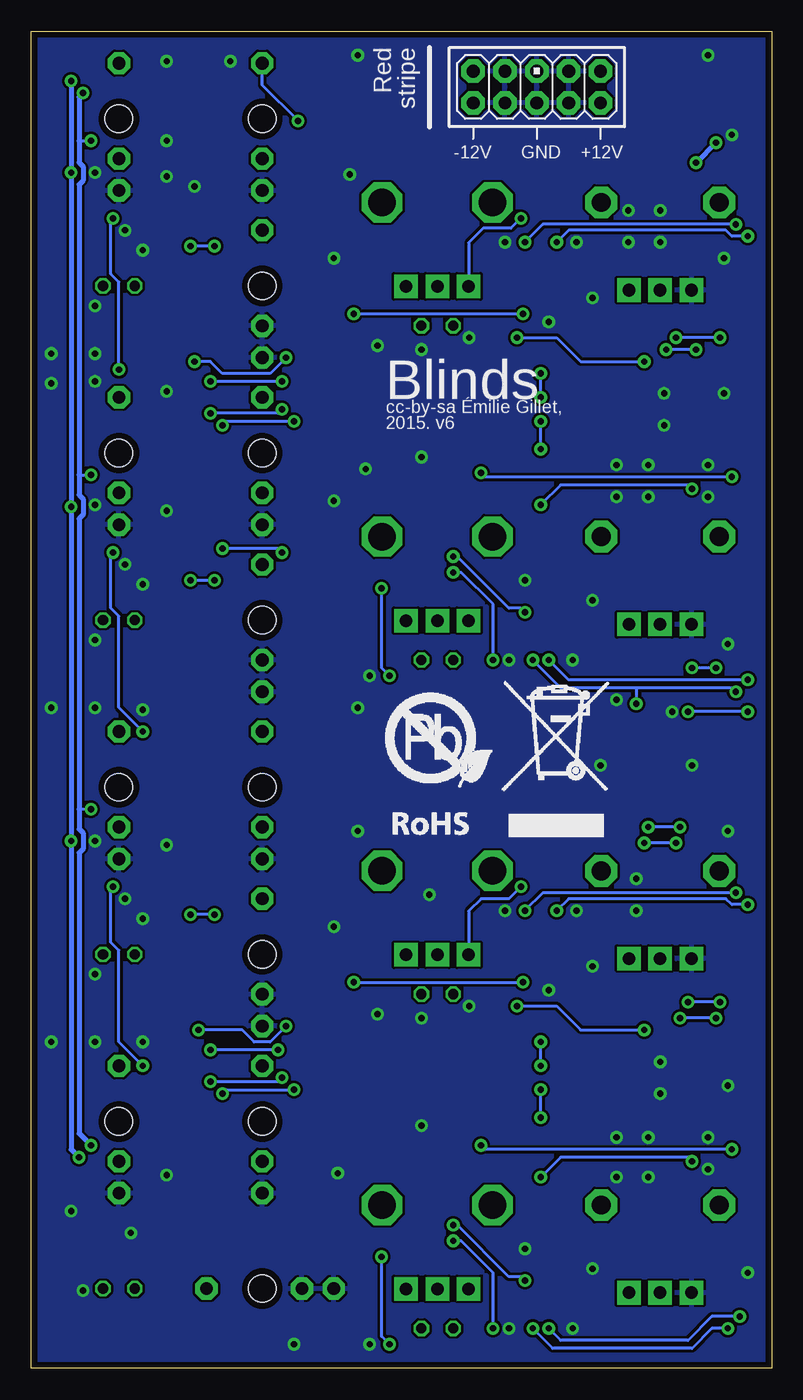
[diagram p6: board, bottom side, seen from below]

Size 59.05 x 106.68 mm. Coordinates in mm from the lower left corner, seen from the top.
Outline: 0,0 59.05,0 59.05,106.68 0,106.68 0,0
Copper layers (1*16): Top 0.035mm / dielectric 1.5mm / Bottom 0.035mm
Design rules "PCBCart-Standard": minimum track width 8mil, minimum drill 0.4mm, track to track 8mil, track to pad 8mil, pad to pad 8mil, via to via 8mil, smd to smd 8mil, copper to edge 20mil, drill to drill 8mil, minimum pad ring 8mil, minimum via ring 10mil, stop-mask expansion 3mil, vias tented up to drill 25mil, thermal gap 8mil

### Footprints (pad centres in the part's own frame; a part is rotated, then mirrored left to right if it is on the bottom)
PANASONIC_C = smd 2.6 x 1.4: + 2.05,0; - -2.05,0
C0603 = smd 1.1 x 1: 1 -0.85,0; 2 0.85,0
SOD123 = smd 1.4 x 1.4: A 1.9,0; C -1.9,0
TSSOP14 = smd 0.305 x 0.991: 1 -1.905,-2.718; 2 -1.27,-2.718; 3 -0.635,-2.718; 4 0,-2.718; 5 0.635,-2.718; 6 1.27,-2.718; 7 1.905,-2.718; 8 1.905,2.718; 9 1.27,2.718; 10 0.635,2.718; 11 0,2.718; 12 -0.635,2.718; 13 -1.27,2.718; 14 -1.905,2.718
SOIC16N = smd 0.6 x 2.2: 1 -4.445,-2.6; 2 -3.175,-2.6; 3 -1.905,-2.6; 4 -0.635,-2.6; 5 0.635,-2.6; 6 1.905,-2.6; 7 3.175,-2.6; 8 4.445,-2.6; 9 4.445,2.6; 10 3.175,2.6; 11 1.905,2.6; 12 0.635,2.6; 13 -0.635,2.6; 14 -1.905,2.6; 15 -3.175,2.6; 16 -4.445,2.6
DBZ_R-PDSO-G3 = smd 0.7 x 1: 1 -0.95,-1.1; 2 0.95,-1.1; 3 0,1.1
WQP_PJ_301M6 = drill 1.016 pad 1.778 octagon: P1 0,-5.715; P2 0,-3.175; P3 0,4.445 | hole 2.2: 0,0
FIDUCIAL-1X2 = smd 1 x 1: 1 0,0
AVR_ICSP = drill 1.016 pad 1.88 octagon: 1 -1.27,5.08; 2 1.27,5.08; 3 -1.27,2.54; 4 1.27,2.54; 5 -1.27,0; 6 1.27,0; 7 -1.27,-2.54; 8 1.27,-2.54; 9 -1.27,-5.08; 10 1.27,-5.08
0603 = smd 0.85 x 0.7: 1 -0.9,0; 2 0.7,0
LED5MM = drill 0.813 octagon: A -1.27,0; K 1.27,0
LED3MM = drill 0.813 octagon: A -1.27,0; K 1.27,0
PTC-1206 = smd 1 x 1.8: 1 -1.4,0; 2 1.4,0
R0603 = smd 1 x 1.1: 1 -0.85,0; 2 0.85,0
ALPS_POT_VERTICAL_PS = drill 1 pad 1.88 square: P$1 -2.5,7; P$2 0,7; P$3 2.5,7 | drill 1.5 pad 2.54 octagon: P$4 -4.7,0; P$5 4.7,0
ALPS_POT_VERTICAL = drill 1 pad 1.88 square: P$1 -2.5,6.7; P$2 0,6.7; P$3 2.5,6.7 | drill 2.2 pad 3.175 octagon: P$4 -4.4,0; P$5 4.4,0

### Placement (x,y rotation side)
C1  30.8,102.55 90 top
C2  6.99,102.23 270 top
C3  43.66,94.3 0 top
C4  54.93,94.14 0 top
C5  49.21,93.66 180 top
C6  17.78,93.34 180 top
C7  16.51,88.58 180 top
C8  20,88.58 180 top
C9  48.26,86.68 0 top
C10  14.29,83.19 270 top
C11  24.13,80.96 0 top
C12  26.35,80.01 90 top
C13  10.48,78.11 90 top
C14  10.48,74.3 90 top
C15  26.35,73.5 270 top
C16  24.13,72.71 180 top
C17  54.93,67.47 0 top
C18  49.21,66.99 180 top
C19  16.83,65.41 90 top
C20  48.26,60.01 0 top
C21  16.83,57.78 180 top
C22  20,57.78 180 top
C23  13.97,56.83 90 top
C24  5.4,50.16 270 top
C25  14.61,50.16 270 top
C26  7.62,46.04 180 top
C27  12.38,46.04 0 top
C28  43.5,40.96 180 top
C29  54.93,40.8 0 top
C30  49.21,40.32 180 top
C31  17.78,40.01 180 top
C32  16.51,35.24 180 top
C33  20,35.24 180 top
C34  48.26,33.34 0 top
C35  14.29,29.84 270 top
C36  24.13,27.62 0 top
C37  26.35,26.67 90 top
C38  10.48,24.77 90 top
C39  10.48,20.95 90 top
C40  26.35,20.16 270 top
C41  24.13,19.37 180 top
C42  54.93,14.29 180 top
C43  49.21,13.65 180 top
C44  16.83,12.06 90 top
C45  48.26,6.67 0 top
C46  16.83,4.45 180 top
C47  20,4.45 180 top
C48  13.97,3.49 90 top
D1  34.77,102.87 270 top
D2  11.11,102.55 90 top
IC1  51.12,90.17 270 top
IC2  18.41,85.09 270 top
IC3  18.41,76.52 270 top
IC4  51.12,63.5 270 top
IC5  18.41,61.28 270 top
IC6  7.62,48.58 180 top
IC7  12.38,48.58 180 top
IC8  51.12,36.83 270 top
IC9  18.41,31.75 270 top
IC10  18.41,23.18 270 top
IC11  51.12,10.16 270 top
IC12  18.41,7.94 270 top
J1  40.64,99.69 0 top
J2  52.07,99.69 0 top
J3  40.64,86.36 0 top
J4  40.64,73.03 0 top
J5  52.07,73.03 0 top
J6  40.64,59.69 0 top
J7  40.64,46.35 0 top
J8  52.07,46.35 0 top
J9  40.64,33.02 0 top
J10  40.64,19.68 0 top
J11  52.07,19.68 0 top
J12  40.64,6.35 270 top
JP1  1.91,104.78 0 top
JP2  57.15,104.3 0 top
JP3  1.91,1.91 0 top
JP4  57.15,1.91 0 top
JP5  18.73,102.23 270 bottom
L1  10.48,99.06 0 top
L2  26.35,99.06 180 top
LED1  52.07,86.36 0 top
LED2  26.67,83.19 180 top
LED3  52.07,59.69 0 top
LED4  26.67,56.52 180 top
LED5  52.07,33.02 0 top
LED6  26.67,29.84 180 top
LED7  52.07,6.35 0 top
LED8  26.67,3.17 180 top
P1  26.67,102.23 90 top
R1  16.67,95.25 180 top
R2  19.68,95.25 0 top
R3  37.47,94.3 180 top
R4  8.89,93.03 180 top
R5  26.67,93.03 180 top
R6  17.78,91.76 180 top
R7  46.35,91.76 270 top
R8  55.24,91.44 270 top
R9  22.86,89.06 270 top
R10  55.88,88.27 270 top
R11  31.75,86.68 90 top
R12  34.92,86.36 90 top
R13  45.88,85.88 90 top
R14  48.26,85.09 180 top
R15  51.75,84.77 0 top
R16  6.67,84.14 180 top
R17  48.26,83.5 0 top
R18  51.75,83.34 0 top
R19  11.11,83.19 270 top
R20  12.7,83.19 270 top
R21  30.48,83.19 0 top
R22  34.92,83.19 270 top
R23  45.88,82.71 270 top
R24  50.01,81.91 180 top
R25  12.38,80.33 0 top
R26  24.13,79.53 180 top
R27  12.06,78.11 90 top
R28  13.65,78.11 270 top
R29  24.13,78.11 0 top
R30  24.13,75.56 0 top
R31  12.7,74.93 180 top
R32  24.13,74.14 180 top
R33  12.7,73.34 0 top
R34  37.47,67.63 180 top
R35  34.92,66.99 90 top
R36  8.89,66.36 180 top
R37  26.67,66.36 180 top
R38  18.26,65.41 90 top
R39  19.68,65.41 90 top
R40  46.35,65.09 270 top
R41  55.24,64.77 270 top
R42  34.92,63.82 270 top
R43  22.86,62.39 270 top
R44  55.88,61.59 270 top
R45  31.75,60.01 90 top
R46  45.88,59.21 90 top
R47  48.26,58.42 180 top
R48  51.75,58.1 0 top
R49  6.67,57.47 180 top
R50  10.79,56.83 270 top
R51  12.38,56.83 90 top
R52  51.75,56.67 0 top
R53  30.48,56.52 0 top
R54  45.88,56.04 270 top
R55  49.05,56.04 90 top
R56  47.47,56.04 270 top
R57  8.57,55.88 180 top
R58  51.43,55.24 180 top
R59  7.62,51.12 0 top
R60  12.38,51.12 180 top
R61  16.67,41.91 180 top
R62  19.68,41.91 0 top
R63  37.47,40.96 180 top
R64  8.89,39.69 180 top
R65  26.67,39.69 180 top
R66  17.78,38.42 180 top
R67  46.35,38.42 270 top
R68  55.24,38.1 270 top
R69  22.86,35.72 270 top
R70  55.88,34.92 270 top
R71  31.75,33.34 90 top
R72  34.92,33.02 90 top
R73  45.88,32.54 90 top
R74  48.26,31.75 180 top
R75  51.75,31.43 0 top
R76  6.67,30.8 180 top
R77  51.75,30 0 top
R78  11.11,29.84 270 top
R79  12.7,29.84 270 top
R80  30.48,29.84 0 top
R81  34.92,29.84 270 top
R82  47.47,29.37 270 top
R83  45.88,29.37 270 top
R84  49.05,29.37 90 top
R85  51.44,28.57 180 top
R86  12.38,26.99 0 top
R87  24.13,26.19 180 top
R88  12.06,24.77 90 top
R89  13.65,24.77 270 top
R90  24.13,24.77 0 top
R91  24.13,22.23 0 top
R92  12.7,21.59 180 top
R93  24.13,20.8 180 top
R94  12.7,20 0 top
R95  37.47,14.29 180 top
R96  34.61,13.34 90 top
R97  8.89,13.02 180 top
R98  26.67,13.02 180 top
R99  45.09,12.7 90 top
R100  46.67,12.7 270 top
R101  18.26,12.06 90 top
R102  19.68,12.06 90 top
R103  42.86,11.75 180 top
R104  34.61,10.16 270 top
R105  23.18,9.05 270 top
R106  31.43,6.67 90 top
R107  48.26,5.24 180 top
R108  51.59,4.6 0 top
R109  6.67,4.13 180 top
R110  54.13,3.81 90 top
R111  10.79,3.49 270 top
R112  12.38,3.49 90 top
R113  30.48,3.17 0 top
R114  47.63,3.02 270 top
R115  51.59,3.02 180 top
R116  49.21,3.02 90 top
R117  7.62,2.54 180 top
U$2  [ROHS_BIG]  32.07,41.59 0 bottom

### Tracks (layer width: path | path; a pad name or v marks a point on that pad's centre or on a via)
1_TO_2  (via drill 0.5)
  Top 0.254: R8.1 55.03,92.08 IC1.14 52.86,92.08 v52.55,91.76 | v52.07,79.69 54.77,79.69 57.78,76.68 57.78,60.01 56.2,58.42 56.2,56.52 53.34,53.66 48.26,53.66 47.47,54.45 R56.2
  Bottom 0.254: v52.55,91.76 52.7,91.6 52.7,87.31 52.07,86.68 v52.07,79.69 | v52.55,91.76
2_TO_3  (via drill 0.5)
  Top 0.254: R41.1 55.03,65.41 IC4.14 52.86,65.41 v52.55,65.09 | v50.16,50.8 51.44,52.07 52.7,52.07 53.34,51.44 56.04,51.44 57.78,49.69 57.78,31.43 53.34,26.99 48.58,26.99 47.62,27.94 47.62,28.36 R82.2
  Bottom 0.254: v50.16,50.8 52.07,52.7 52.07,60.01 52.7,60.64 52.7,64.93 v52.55,65.09
3_TO_4  (via drill 0.5)
  Top 0.254: R68.1 55.03,38.73 IC8.14 52.86,38.73 v52.55,38.42 | R114.2 47.62,1.43 47.78,1.27 55.09,1.27 56.04,2.22 56.04,4.13 57.47,5.56 57.47,22.86 55.56,24.77 53.66,24.77 53.02,25.4 51.44,25.4 v50.16,24.13
  Bottom 0.254: v52.55,38.42 52.7,38.26 52.7,33.97 52.07,33.34 52.07,26.04 v50.16,24.13
AREF_+5
  Top 0.254: IC11.14 IC11.13
AREF_+10  (via drill 0.5)
  Top 0.254: R20.2 12.7,81.6 12.38,81.28 v8.41,81.28 | 6.99,70.17 6.99,65.09 4.45,62.55 v4.45,55.88 4.45,55.56 6.67,53.34 8.26,53.34 9.84,51.75 9.84,46.04 | 6.99,70.17 6.99,80.64 6.35,81.28 | 6.35,81.28 4.76,82.87 4.76,87 5.4,87.63 8.89,87.63 10.48,89.22 10.48,93.66 12.06,95.25 R1.2 15.88,95.31 15.88,95.89 16.19,96.2 34.92,96.2 35.56,95.57 35.56,93.66 35.88,93.34 38.42,93.34 | 6.35,81.28 v6.03,81.28 | 9.84,46.04 C26.1 8.47,49.58 IC6.1 8.57,51.02 R59.2 | v6.35,55.88 R57.2 | 8.26,41.91 8.26,38.42 4.45,34.61 4.45,30.48 5.08,29.84 5.08,27.94 | 8.26,41.91 8.26,43.81 9.84,45.4 9.84,46.04 | R79.2 12.7,28.26 12.38,27.94 v7.3,27.94 | v10.16,41.91 R61.2 | 8.26,41.91 v7.62,41.91 | R117.2 5.4,2.54 4.13,3.81 4.13,10.48 6.99,13.34 6.99,16.51 | 6.99,16.51 6.99,24.45 5.08,26.35 5.08,27.94 | R101.2 18.41,13.07 v18.41,15.24 | 6.99,16.51 v6.35,16.51 | R38.2 18.41,66.41 v18.41,68.9 | 6.99,70.17 v6.35,70.17 | 5.08,27.94 v4.45,27.94 | 43.18,68.58 43.18,66.04 42.86,65.72 42.86,61.91 44.13,60.64 44.13,41.91 | 43.18,68.58 43.18,74.61 42.86,74.93 42.86,75.56 43.81,76.52 43.81,79.06 44.13,79.38 44.13,88.58 43.5,89.22 43.5,92.08 42.86,92.71 | R95.1 39.05,14.29 40.01,15.24 41.91,15.24 43.5,16.83 43.5,20.95 42.86,21.59 42.86,22.23 43.81,23.18 43.81,25.72 44.13,26.04 44.13,35.24 43.5,35.88 43.5,36.51 44.13,37.15 44.13,39.69 44.35,39.9 C28.1 44.35,41.7 44.13,41.91 | R63.1 39.05,40.96 40.01,41.91 44.13,41.91 | R34.1 39.05,67.63 40.01,68.58 43.18,68.58 | 38.42,93.34 39.05,92.71 42.86,92.71 | R3.1 38.42,94.19 38.42,93.34 | C3.1 42.86,94.24 42.86,92.71
  Bottom 0.254: v6.03,81.28 v8.41,81.28 | v4.45,55.88 v6.35,55.88 | v7.62,41.91 v10.16,41.91 | v18.41,15.24 16.83,16.83 6.67,16.83 v6.35,16.51 | v18.41,68.9 16.83,70.48 6.67,70.48 v6.35,70.17 | v4.45,27.94 v7.3,27.94
AREF_-10
  Top 0.254: 7.62,76.2 7.62,64.77 5.08,62.23 5.08,58.1 5.71,57.47 R49.2 5.82,56.94 5.4,56.52 5.4,55.56 6.99,53.98 8.57,53.98 10.48,52.07 10.48,46.04 | 7.62,76.2 7.62,80.96 5.82,82.77 R16.2 | 10.48,46.04 C27.1 11.53,49.58 IC7.2 11.43,51.02 R60.2 | 10.48,46.04 10.48,45.09 8.89,43.5 8.89,38.1 4.92,34.13 4.92,31.27 5.4,30.8 R76.2 5.82,26.41 7.62,24.61 7.62,22.86 | R92.2 11.75,21.69 11.75,22.86 | 7.62,22.86 7.62,15.88 7.62,13.02 4.76,10.16 4.76,4.45 5.08,4.13 R109.2 | 7.62,22.86 11.75,22.86 | R89.2 13.65,23.18 13.34,22.86 11.75,22.86 | R31.2 11.75,75.03 11.75,76.2 | 7.62,76.2 11.75,76.2 | R28.2 13.65,76.52 13.34,76.2 11.75,76.2
CV_IN_1
  Top 0.254: J3.P3 34.29,90.81 31.75,88.27 R11.2
FOO
  Top 0.254: R27.2 R28.1 13.76,79.06 14.29,79.06 14.92,79.69 IC3.2
FOO1
  Top 0.254: IC3.7 R33.2 R31.1
FOO2
  Top 0.254: IC10.2 14.92,26.35 14.29,25.72 13.76,25.72 R89.1 R88.2
FOO3
  Top 0.254: R92.1 R94.2 IC10.7
GAIN_1  (via drill 0.5)
  Top 0.254: IC2.1 14.92,87 14.61,87.31 14.61,90.17 15.24,90.81 18.26,90.81 | v19.84,84.14 18.26,85.72 18.26,90.81 | 18.26,90.81 18.63,91.18 R6.1 C6.1 | R29.2 30.8,78.11 33.34,80.64 | R23.2 46.04,81.7 v46.04,80.33 | 33.34,80.64 34.92,80.64 | 34.92,80.64 v38.73,80.64 | 33.34,80.64 v33.34,84.14 | 34.92,80.64 R22.2
  Bottom 0.254: v46.04,80.33 44.77,80.33 43.81,79.38 40.01,79.38 v38.73,80.64 | v33.34,84.14 v19.84,84.14
GAIN_2  (via drill 0.5)
  Top 0.254: 14.61,55.88 14.07,55.88 14.07,55.98 C23.1 R51.1 | 14.61,55.88 14.92,55.56 21.27,55.56 v22.23,56.52 | 14.61,55.88 14.92,56.2 14.92,58.42 15.56,59.05 15.56,59.37 IC5.7 | 46.09,55.19 R54.2 45.14,55.19 44.77,55.56 44.77,60.96 43.5,62.23 43.5,65.09 v43.81,65.41 v43.81,75.25 | v38.1,75.56 R30.2 | v25.4,63.5 33.34,63.5 33.87,62.97 R42.2 36.93,62.97 v39.05,65.09
  Bottom 0.254: v25.4,63.5 24.77,63.5 22.23,60.96 v22.23,56.52 | v39.05,65.09 39.37,65.41 v43.81,65.41 | v38.1,75.56 43.5,75.56 v43.81,75.25
GAIN_3  (via drill 0.5)
  Top 0.254: C31.1 R66.1 18.63,37.84 18.26,37.47 | IC9.1 14.92,33.66 13.97,34.61 13.97,36.2 15.24,37.47 18.26,37.47 | 45.82,28.57 R83.2 45.88,28.1 45.72,27.94 v45.72,26.99 | 33.34,27.3 34.92,27.3 | 34.92,27.3 v38.73,27.3 | 18.26,37.47 18.26,32.38 v19.84,30.8 | 33.34,27.3 v33.34,30.8 | 33.34,27.3 30.8,24.77 R90.2 | 34.92,27.3 R81.2
  Bottom 0.254: v38.73,27.3 40.01,26.04 41.27,26.04 42.23,26.99 v45.72,26.99 | v33.34,30.8 v19.84,30.8
GAIN_4  (via drill 0.5)
  Top 0.254: R112.1 C48.1 14.07,2.54 14.61,2.54 | 14.61,2.54 14.92,2.86 14.92,5.08 15.7,5.86 IC12.7 | 14.61,2.54 14.92,2.54 15.24,2.22 21.27,2.22 v22.23,3.17 | v38.1,22.23 R91.2 | v43.81,21.91 44.13,21.59 44.13,16.51 43.5,15.88 43.5,13.02 43.18,12.7 42.23,12.7 42.01,12.48 R103.2 40.32,11.75 37.78,9.21 34.71,9.21 R104.2 33.55,9.31 33.02,9.84 25.72,9.84 v25.4,10.16
  Bottom 0.254: v22.23,3.17 22.23,7.62 24.77,10.16 v25.4,10.16 | v38.1,22.23 43.5,22.23 v43.81,21.91
GND  (via drill 0.5)
  other vias: 51.59,90.8 50.16,89.22 53.98,84.77 21.27,89.85 53.98,95.41 48.26,95.09 15.56,89.85 27.94,81.28 14.29,85.41 27.94,72.71 32.07,55.24 15.88,56.52 20.95,56.52 53.98,58.1 53.98,68.9 51.59,64.13 50.17,62.55 48.26,68.42 8.57,77.79 8.57,75.25 19.68,62.87 14.29,61.28 57.47,78.58 24.13,82.23 12.38,72.07 17.78,83.5 12.38,69.53 8.89,92.39 8.89,89.85 11.43,92.39 11.43,89.85 5.08,72.07 5.08,69.53 3.49,57.78 7.94,52.39 13.65,48.1 6.35,48.1 12.38,53.34 9.84,72.07 9.84,69.53 31.43,81.6 34.92,69.21 33.02,104.78 5.08,104.78 10.79,39.05 10.79,36.51 8.89,24.45 8.89,21.91 9.84,18.41 12.38,18.41 9.84,15.24 12.38,15.24 14.29,32.07 17.78,30.16 15.56,36.51 21.27,36.51 24.13,28.89 27.94,27.94 27.94,19.37 31.43,28.26 14.29,7.94 19.68,9.53 15.88,3.17 20.95,3.17 32.07,1.91 34.61,15.56 48.26,41.75 53.98,42.07 51.59,37.47 50.16,35.88 53.98,31.43 57.47,26.04 55.88,12.54 51.12,10.79 53.98,80.96 57.47,80.96 57.47,52.7 53.98,52.7 50.16,26.04 53.98,26.04 54.93,6.19 48.26,15.4 33.66,95.25 1.91,7.62 3.49,22.54 3.49,42.86 3.81,77.79 3.81,88.58 3.17,98.42 48.26,104.3 43.18,104.3 38.1,1.91 33.02,42.86 27.3,37.78 33.02,52.7 32.38,71.75 34.92,88.58 48.26,97.95 48.26,77.95 50.16,52.55 5.08,18.41 5.08,15.88 53.98,78.74 34.92,35.24 46.04,94.3
  pour Bottom: 0,106.68 0,0 59.05,0 59.05,106.68
  pour Top (isolate 0.203): 0,106.68 0,0 59.05,0 59.05,106.68
N$1
  Top 0.254: R25.2 13.97,80.33 14.61,80.96 IC3.1
N$2
  Top 0.254: R16.1 8.57,84.14 8.89,84.45 R4.P$2
N$3  (via drill 0.5)
  Top 0.254: IC3.13 28.89,77.15 | 28.89,77.15 30.48,77.15 | R7.2 46.14,91.12 R7.2 | IC1.2 | IC1.2 47.62,91.44 47.09,90.91 R7.2 | v46.35,89.53 R7.2 | v44.45,89.53 44.77,89.22 44.77,82.23 v44.77,78.74 | v39.05,78.74 37.47,77.15 28.89,77.15
  Bottom 0.254: v44.45,89.53 v46.35,89.53 | v39.05,78.74 v44.77,78.74
N$4
  Top 0.254: IC2.8 LED2.K
N$5
  Top 0.254: R5.P$1 29.17,87.35 28.31,88.21 R9.2 22.86,87.63 22.54,87.31 22.54,87 21.91,86.36 IC2.13
N$6
  Top 0.254: J5.P3 56.04,77.47 57.31,76.2 57.31,60.33 55.56,58.58 55.56,56.83 53.02,54.29 49.53,54.29 49.21,54.61 49.21,55.03 R55.1
N$7
  Top 0.254: J2.P3 56.04,104.14 57.47,102.71 57.47,82.87 56.52,81.92 52.39,81.92 51.44,80.96 48.58,80.96 47.62,81.92 47.62,83.29 R17.1
N$8
  Top 0.254: R2.2 23.18,95.25 24.45,93.98 24.45,92.08 23.18,90.81 22.86,90.49 R9.1 22.6,89.91 21.91,89.22 21.91,87.31 21.59,87 IC2.14
N$9  (via drill 0.5)
  Top 0.254: v20,91.76 19.68,92.08 19.68,93.98 18.84,94.83 R2.1 R1.1 17.52,94.67 16.83,93.98 16.83,93.45 C6.2 R6.2 16.19,91.76 15.72,91.28 14.76,91.28 13.97,90.49 13.97,86.36 | R4.P$1 11.72,86.36 13.97,86.36 | 13.97,86.36 IC2.2
  Bottom 0.254: v20,91.76 20.8,90.96 23.02,90.96 24.17,89.81 R5.P$3
N$10
  Top 0.254: IC1.6 | IC1.6 47.78,88.9 47.47,88.58 47.47,86.73 C9.1 47.35,86.62 47.41,86.56 R14.2 45.94,85.09 R13.1 R23.1 | R23.1
N$11
  Top 0.406: JP5.2 JP5.1 12.71,104.45 D2.A
N$12
  Top 0.406: JP5.10 JP5.9 23.94,103.64 P1.2
N$13
  Top 0.406: P1.1 25.65,99.82 L2.2
N$14
  Top 0.254: R5.P$2 26.67,85.41 27.3,84.77 31.43,84.77 31.75,85.09 R11.1
N$15
  Top 0.254: IC2.9 24.45,83.82 24.77,84.14 26.04,84.14 26.99,83.19 LED2.A R21.1
N$16
  Top 0.406: D2.C 11.18,100.59 L1.2
N$17
  Top 0.254: R32.1 25.2,74.35 C15.1
N$18
  Top 0.254: LED1.K 53.84,86.86 IC1.8
N$19
  Top 0.254: IC1.9 53.02,88.9 50.8,86.68 LED1.A 50.8,84.88 R15.1
N$20
  Top 0.254: R27.1 C13.1
N$21  (via drill 0.5)
  Top 0.254: R19.2 11.01,82.23 v7.62,82.23 | v4.13,82.23 4.13,87.31 5.08,88.27 8.57,88.27 9.84,89.53 9.84,93.98 12.7,96.84 35.08,96.84 v37.78,99.54
  Bottom 0.254: v37.78,99.54 40.64,102.39 J1.P3 | v4.13,82.23 v7.62,82.23
N$22
  Top 0.254: IC1.13 54.61,91.44 55.24,90.81 R8.2 55.88,89.95 R10.1
N$23
  Top 0.254: 57.31,39.85 57.31,31.91 53.02,27.62 49.53,27.62 49.21,27.94 49.21,28.36 R84.1 | J8.P3 55.72,50.8 57.31,49.21 57.31,39.85 | 57.31,39.85
N$24
  Top 0.254: R30.1 R32.2 23.02,74.14 22.23,73.34 IC3.10
N$25
  Top 0.254: J2.P2 56.04,96.52 56.83,95.73 56.83,87.63 56.52,87.31 55.98,87.31 R10.2
N$26  (via drill 0.5)
  Top 0.254: IC3.12 21.91,75.88 22.54,76.52 30.16,76.52 v39.05,76.52 | IC4.2 | IC4.2 47.31,64.77 46.77,64.24 R40.2 v46.35,62.87 | v44.77,76.2 44.77,63.18 v44.45,62.87
  Bottom 0.254: v44.45,62.87 v46.35,62.87 | v39.05,76.52 39.37,76.2 v44.77,76.2
N$27
  Top 0.254: R47.2 C20.1 47.41,62.02 47.62,62.23 IC4.6 | 47.35,56.89 47.41,56.95 R56.1 47.47,58.36 R47.2 | R47.2 45.94,58.42 R46.1 R54.1
N$28
  Top 0.254: J6.P3 39.05,64.14 35.77,60.86 R45.2
N$29
  Top 0.254: R37.P$1 29.17,61 28.63,61.54 R43.2 22.76,61.54 21.75,62.55 IC5.13
N$30  (via drill 0.5)
  Top 0.254: v31.11,62.23 24.77,62.23 23.76,63.24 R43.1 22.8,63.18 IC5.14 | R50.2 10.79,55.56 11.43,54.93 30.16,54.93 v30.48,55.24
  Bottom 0.254: v30.48,55.24 31.11,55.88 v31.11,62.23
N$31
  Top 0.254: R51.2 C23.2 13.97,59.05 14.92,60.01 IC5.6 | R50.1 R51.2 | R51.2 12.34,57.72 | R50.1 10.06,57.68 9.53,57.15 9.53,55.98 R57.1 9.42,55.03 10.16,54.29 32.38,54.29 33.02,54.93 33.02,57.15 32.7,57.47 26.99,57.47 26.35,58.1 25.08,58.1 24.17,59.02 R37.P$3 | R36.P$1 10.79,58.76 R50.1
N$32
  Top 0.254: R36.P$2 8.89,58.1 8.26,57.47 R49.1
N$33
  Top 0.254: IC5.8 21.91,59.37 22.38,58.9 22.38,57.94 23.81,56.52 LED4.K
N$34
  Top 0.254: R53.1 LED4.A 26.99,56.52 26.04,57.47 23.81,57.47 22.86,58.42 22.86,59.37 22.23,60.01 IC5.9
N$35
  Top 0.254: LED3.K 53.84,60.19 IC4.8
N$36
  Top 0.254: IC4.9 53.02,62.23 50.8,60.01 LED3.A 50.8,58.2 R48.1
N$37
  Top 0.254: IC4.13 54.61,64.77 55.24,64.14 R41.2 55.88,63.28 R44.1
N$38
  Top 0.254: J5.P2 56.04,69.85 56.83,69.06 56.83,60.96 56.62,60.74 R44.2
N$39
  Top 0.254: IC4.1 47.31,65.41 46.77,65.94 R40.1 45.62,65.94 45.4,65.72 45.4,65.41 45.4,61.28 45.72,60.96 45.72,60.22 R46.2
N$40
  Top 0.254: R37.P$2 26.67,58.74 27.3,58.1 31.43,58.1 31.75,58.42 R45.1
N$41
  Top 0.254: C14.1 10.58,73.34 R33.1
N$42  (via drill 0.5)
  Top 0.254: R39.1 R38.1 C19.1 16.83,62.87 16.51,62.55 IC5.2 14.92,62.55 14.61,62.87 14.61,63.5 15.24,64.14 15.24,65.72 15.88,66.36 15.88,66.99 16.19,67.31 16.19,69.53 18.41,71.75 v18.41,73.34 | v18.41,75.56 18.1,75.88 IC3.5
  Bottom 0.254: v18.41,73.34 v18.41,75.56
N$43
  Top 0.254: 19.37,74.61 IC3.6 | 19.37,74.61 IC3.11 | IC5.1 15.88,63.36 15.88,65.41 16.73,66.25 C19.2 | C19.2 16.73,66.36 16.83,66.46 | 19.37,74.61 19.37,71.75 16.83,69.22 C19.2
N$44
  Top 0.254: R39.2 19.68,67.31 20.95,68.58 32.7,68.58 35.88,71.75 38.1,73.98 40.64,76.52 J4.P3
N$45
  Top 0.254: R87.1 25.35,25.82 C37.1
N$46
  Top 0.254: IC10.15 23.12,26.35 R87.2 R90.1
N$47
  Top 0.254: R26.1 25.35,79.16 C12.1
N$48  (via drill 0.5)
  Top 0.254: IC10.13 29.53,23.81 | 29.53,23.81 30.48,23.81 | IC8.2 47.31,38.1 46.77,37.57 R67.2 46.25,37.57 46.04,37.78 46.35,37.47 v46.35,36.2 | v44.45,36.2 44.77,35.88 v44.77,25.4 | v39.37,25.4 37.78,23.81 29.53,23.81
  Bottom 0.254: v44.45,36.2 v46.35,36.2 | v39.37,25.4 v44.77,25.4
N$49
  Top 0.254: IC8.6 47.62,35.56 47.41,35.34 C34.1 R74.2 | R82.1 47.41,30.27 R74.2 | R74.2 45.94,31.75 R73.1 R83.1 | R83.1
N$50
  Top 0.254: R71.2 31.75,34.92 34.29,37.47 J9.P3
N$51
  Top 0.254: IC9.13 22.54,33.02 22.86,33.34 R69.2 28.31,34.87 29.17,34.01 R65.P$1
N$52
  Top 0.254: R62.2 23.18,41.91 24.45,40.64 24.45,38.73 23.18,37.47 22.86,37.15 R69.1 22.6,36.57 21.91,35.88 21.91,33.97 21.59,33.66 IC9.14
N$53  (via drill 0.5)
  Top 0.254: v20,38.42 19.68,38.73 19.68,40.64 18.84,41.49 R62.1 R61.1 17.46,41.85 17.46,41.27 16.93,40.74 C31.2 R66.2 16.19,38.42 15.72,37.94 14.76,37.94 13.34,36.51 13.34,33.02 | R64.P$1 11.72,33.02 13.34,33.02 | 13.34,33.02 IC9.2
  Bottom 0.254: v20,38.42 20.95,37.47 23.18,37.47 24.17,36.47 R65.P$3
N$54
  Top 0.254: R3.2 36.62,95.03 36.83,95.25 37.15,95.25 38.1,95.25 39.37,96.52 J1.P2
N$55
  Top 0.254: R76.1 8.26,30.8 8.89,31.43 R64.P$2
N$56
  Top 0.254: IC9.8 LED6.K
N$57
  Top 0.254: IC9.9 24.45,30.48 24.77,30.8 26.04,30.8 26.99,29.84 LED6.A R80.1
N$58
  Top 0.254: LED5.K 53.84,33.52 IC8.8
N$59
  Top 0.254: IC8.9 53.02,35.56 50.8,33.34 LED5.A 50.8,31.54 R75.1
N$60
  Top 0.254: IC8.13 54.61,38.1 55.24,37.47 R68.2 55.88,36.62 R70.1
N$61
  Top 0.254: J8.P2 56.04,43.18 56.83,42.39 56.83,34.29 56.62,34.08 R70.2
N$62
  Top 0.254: IC8.1 47.31,38.73 46.77,39.27 R67.1 45.62,39.27 45.4,39.05 45.4,38.73 45.4,34.61 45.72,34.29 45.72,33.55 R73.2
N$63
  Top 0.254: R88.1 C38.1
N$64
  Top 0.254: IC1.1 | IC1.1 47.62,92.08 47.09,92.61 R7.1 45.62,92.61 45.4,92.39 45.4,92.08 45.4,89.53 45.4,87.95 45.72,87.63 45.72,87.31 45.72,86.89 R13.2
N$65  (via drill 0.5)
  Top 0.254: v18.41,77.47 18.1,77.15 IC3.4 | R19.1 R20.1 C10.1 14.5,83.82 IC2.6 16.51,83.82 16.83,83.5 16.83,83.19 18.41,81.6 v18.41,79.38
  Bottom 0.254: v18.41,77.47 v18.41,79.38
N$66
  Top 0.254: IC3.3 17.46,78.42 | 17.46,78.42 IC3.14 | C10.2 14.39,82.23 15.88,82.23 | 15.88,82.23 16.83,82.23 17.46,81.6 17.46,78.42 | IC2.7 15.88,83.01 15.88,82.23
N$67  (via drill 0.5)
  Top 0.254: R78.1 R79.1 C35.1 14.5,30.48 IC9.6 16.51,30.48 16.83,30.16 16.83,29.84 18.41,28.26 v18.41,26.04 | IC10.4 18.1,23.81 v18.41,24.13
  Bottom 0.254: v18.41,24.13 v18.41,26.04
N$68
  Top 0.254: C35.2 14.39,28.89 15.88,28.89 | 15.88,28.89 16.83,28.89 17.46,28.26 17.46,25.08 | IC10.3 17.46,25.08 | 17.46,25.08 IC10.14 | IC9.7 15.88,29.67 15.88,28.89
N$69
  Top 0.254: R102.2 19.68,13.65 22.23,16.19 33.66,16.19 40.64,23.18 J10.P3 40.64,23.5
N$70
  Top 0.254: R65.P$2 26.67,32.07 27.3,31.43 31.43,31.43 31.75,31.75 R71.1
N$71
  Top 0.254: J11.P3 55.24,24.13 56.83,22.54 56.83,5.71 55.56,4.45 55.56,2.7 54.93,2.06 49.31,2.06 R116.1
N$72
  Top 0.254: R93.1 25.2,21.01 C40.1
N$73
  Top 0.254: R91.1 R93.2 23.02,20.8 22.23,20 IC10.10
N$74  (via drill 0.5)
  Top 0.254: IC10.12 21.91,22.54 22.54,23.18 30.48,23.18 v39.05,23.18 | IC11.2 47.62,11.43 47.2,11.85 R100.2 46.67,12.7 44.13,12.7 44.13,15.56 44.77,16.19 v44.77,22.86
  Bottom 0.254: v39.05,23.18 39.37,22.86 v44.77,22.86
N$75
  Top 0.254: IC3.15 23.12,79.69 R26.2 R29.1
N$76
  Top 0.254: R114.1 47.62,5.02 R107.2 C45.1 47.47,6.72 47.47,8.89 | 47.47,8.89 47.47,10.32 46.99,10.79 45.4,10.79 45.09,11.11 R99.1 43.81,11.85 R103.1 | 47.47,8.89 IC11.6
N$77
  Top 0.254: R106.2 31.54,7.62 39.05,7.62 39.69,8.26 42.23,8.26 44.13,6.35 J12.P3
N$78
  Top 0.254: R98.P$1 29.17,7.66 28.63,8.2 R105.2 22.76,8.2 21.75,9.21 IC12.13
N$79  (via drill 0.5)
  Top 0.254: R111.2 10.79,2.22 11.43,1.59 30.16,1.59 v30.48,1.91 | v31.11,8.89 25.4,8.89 24.39,9.9 R105.1 23.12,9.84 IC12.14
  Bottom 0.254: v30.48,1.91 31.11,2.54 v31.11,8.89
N$80
  Top 0.254: R111.1 10.06,4.34 9.84,4.13 9.84,2.54 | R111.1 R112.2 | R112.2 C48.2 13.97,5.71 14.92,6.67 IC12.6 | R112.2 12.34,4.38 | R98.P$3 24.17,5.67 25.08,4.76 26.35,4.76 26.99,4.13 32.38,4.13 33.02,3.49 33.02,1.59 32.38,0.95 10.48,0.95 9.84,1.59 9.84,2.54 | 9.84,2.54 R117.1 | R97.P$1 10.79,5.42 R111.1
N$81
  Top 0.254: R109.1 7.94,4.13 8.89,5.08 R97.P$2
N$82
  Top 0.254: IC12.8 21.91,6.03 22.38,5.56 22.38,4.29 23.5,3.17 LED8.K
N$83
  Top 0.254: IC12.9 22.23,6.67 22.86,6.03 22.86,4.76 23.5,4.13 26.04,4.13 26.99,3.17 LED8.A R113.1
N$84
  Top 0.254: LED7.K 53.84,6.84 IC11.8
N$85
  Top 0.254: IC11.9 53.02,8.89 50.8,6.67 LED7.A 50.8,4.66 R108.1
N$86
  Top 0.254: R86.2 13.97,26.99 14.61,27.62 IC10.1
N$87
  Top 0.254: J4.P2 39.37,69.85 38.1,68.58 36.83,68.58 36.62,68.36 R34.2
N$88
  Top 0.254: R99.2 R100.1 46.89,13.34 46.99,13.34 48.26,12.06 IC11.1
N$89
  Top 0.254: R98.P$2 26.67,5.4 27.3,4.76 31.11,4.76 31.43,5.08 R106.1
N$90
  Top 0.254: C39.1 10.58,20 R94.1
N$91  (via drill 0.5)
  Top 0.254: R102.1 R101.1 C44.1 16.83,9.53 16.51,9.21 IC12.2 14.92,9.21 14.61,9.53 14.61,10.48 15.24,11.11 15.24,12.38 15.56,12.7 15.56,13.34 16.19,13.97 16.19,15.88 18.41,18.1 v18.41,20 | IC10.5 18.1,22.54 v18.41,22.23
  Bottom 0.254: v18.41,20 v18.41,22.23
N$92
  Top 0.254: 19.37,21.27 IC10.6 | 19.37,21.27 IC10.11 | IC12.1 15.88,10.02 15.88,12.06 16.73,12.91 | 16.73,12.91 C44.2 | 16.73,12.91 16.83,13.02 16.83,15.56 19.37,18.1 19.37,21.27
N$93  (via drill 0.5)
  Top 0.254: R78.2 11.01,28.89 6.99,28.89 v6.67,29.21 | v7.3,43.18 6.67,42.55 6.67,37.78 3.97,35.08 3.97,29.69 4.13,29.53 v4.13,29.21 | v9.84,43.18 30.48,43.18 38.1,50.8 J7.P3
  Bottom 0.254: v7.3,43.18 v9.84,43.18 | v4.13,29.21 v6.67,29.21
N$94
  Top 0.254: J7.P2 39.37,43.18 38.1,41.91 36.83,41.91 36.62,41.7 R63.2
N$95
  Top 0.254: J10.P2 39.37,16.51 38.1,15.24 36.83,15.24 36.62,15.03 R95.2
N$96
  Top 0.254: IC1.10 | IC1.10 54.61,89.53 54.93,89.22 54.93,83.82 53.5,82.39 51.91,82.39 51.44,81.92 R24.1 50.86,83.3 R18.1
N$97
  Top 0.254: IC4.10 | IC4.10 54.61,62.87 54.93,62.55 54.93,57.15 53.02,55.24 R58.1 52.28,55.29 R52.1
N$98
  Top 0.254: IC8.10 54.61,36.2 54.93,35.88 54.93,30.48 53.02,28.57 R85.1 52.28,28.62 R77.1
N$99
  Top 0.254: IC2.10 24.13,84.45 24.45,84.77 26.35,84.77 26.99,84.14 32.07,84.14 33.44,85.51 R12.1 R22.1
N$100
  Top 0.254: R115.1 52.5,2.96 R110.1 | R110.1 54.19,3.02 | IC11.10 55.24,9.53 56.04,8.73 56.04,5.71 55.09,4.76 55.09,3.33 54.71,2.96 R110.1
N$101  (via drill 0.5)
  Top 0.254: R96.1 R104.1 33.55,11.01 33.02,10.48 26.35,10.48 v25.4,11.43 | IC12.10 20,7.3 v19.68,6.99
  Bottom 0.254: v19.68,6.99 20,7.3 20.95,7.3 25.08,11.43 v25.4,11.43
N$102
  Top 0.254: R81.1 R72.1 33.44,32.17 32.07,30.8 26.99,30.8 26.35,31.43 24.45,31.43 24.13,31.11 IC9.10
N$103  (via drill 0.5)
  Top 0.254: v25.4,64.77 26.04,64.14 33.34,64.14 33.87,64.67 R42.1 R35.1 | v19.68,60.33 20,60.64 IC5.10
  Bottom 0.254: v25.4,64.77 25.08,64.77 20.95,60.64 20,60.64 v19.68,60.33
OUT1
  Top 0.254: R24.2 49.11,81.96 R17.2 R14.1 C9.2 49.11,87.56 IC1.7
OUT2
  Top 0.254: IC4.7 49.21,61.59 49.21,60.11 C20.2 R47.1 49.11,56.95 R55.2 49.05,56.78 R58.2
OUT3
  Top 0.254: IC8.7 49.21,34.92 49.21,33.44 C34.2 R74.1 49.11,30.27 | 49.11,30.27 R84.2 | 49.11,30.27 50.59,28.8 R85.2
OUT4
  Top 0.254: IC11.7 49.05,8.26 49.05,6.72 C45.2 R107.1 49.11,3.97 R116.2 | R116.2 49.11,3.76 | R116.2 50.06,3.02 R115.2
VCC  (via drill 0.5)
  Top 0.254: v17.14,89.85 17.36,89.64 C7.1 17.46,88.48 17.46,85.09 | v54.29,97.95 51.12,97.95 50.06,96.89 C5.1 50.06,90.7 49.53,90.17 IC1.4 | IC5.4 17.14,61.28 17.68,60.74 C21.1 17.78,57.68 v17.78,56.52 | IC4.4 49.53,63.5 50.06,64.03 C18.1 50.16,67.09 50.16,70.33 51.12,71.28 v54.29,71.28 | IC3.16 C11.1 23.28,81.5 22.86,81.92 20.64,81.92 v20.32,82.23 17.46,85.09 | 17.46,85.09 IC2.4 | v6.67,52.39 6.67,51.22 R59.1 5.5,51.12 C24.1 | v17.14,36.51 17.46,36.2 17.46,35.34 C32.1 17.46,35.14 17.46,31.75 | IC10.16 C36.1 23.28,28.16 22.86,28.57 20.64,28.57 v20.32,28.89 17.46,31.75 | 17.46,31.75 IC9.4 | IC12.4 17.14,7.94 17.78,7.3 17.78,4.55 C46.1 17.78,4.34 v17.78,3.17 | IC8.4 49.53,36.83 50.06,37.36 C30.1 50.16,40.42 50.16,43.34 51.44,44.61 v54.29,44.61 | IC11.4 49.53,10.16 50.06,10.69 C43.1 50.16,13.76 50.16,16.51 51.44,17.78 v54.29,17.78 | v10.16,26.99 R86.1 | v10.16,80.33 R25.1
  Top 0.406: v54.93,101.76 54.61,102.08 38.1,102.08 35.72,99.69 33.34,99.69 31.11,97.47 6.67,97.47 6.03,96.84 v6.03,96.2 | 4.76,97.47 1.59,94.3 1.59,90.65 v1.91,90.33 1.91,67.63 1.59,67.31 1.59,65.41 1.91,65.09 v1.91,54.93 v1.91,52.39 1.91,40.96 1.59,40.64 1.59,37.31 v1.91,36.99 1.91,14.29 1.59,13.97 1.59,12.06 2.86,10.79 2.86,4.45 v2.54,4.13 | 4.76,97.47 6.99,99.69 C2.+ 8.08,100.19 9.21,99.06 L1.1 | 4.76,97.47 v4.45,97.79
  Bottom 0.254: 55.24,97.95 v54.29,97.95 | 55.24,71.28 v54.29,71.28 | v17.14,89.85 16.19,90.81 3.65,90.81 3.17,90.33 v1.91,90.33 | v17.78,56.52 16.19,54.93 v1.91,54.93 | v1.91,52.39 v6.67,52.39 | v17.14,36.51 16.19,37.47 3.65,37.47 3.17,36.99 v1.91,36.99 | v17.78,3.17 16.83,2.22 6.67,2.22 4.76,4.13 v2.54,4.13 | 55.24,44.61 v54.29,44.61 | v10.16,26.99 15.24,26.99 17.14,28.89 v20.32,28.89 | v10.16,80.33 15.24,80.33 17.14,82.23 v20.32,82.23
  Bottom 0.406: v54.93,101.76 55.24,101.44 55.24,97.95 55.24,96.2 54.93,95.89 54.93,94.77 55.24,94.46 55.24,71.28 55.24,69.69 54.93,69.37 54.93,68.1 55.24,67.79 55.24,44.61 55.24,43.02 54.93,42.7 54.93,41.43 55.24,41.12 55.24,18.73 v54.29,17.78 | v4.45,97.79 v6.03,96.2
VEE  (via drill 0.5)
  Top 0.254: IC3.9 22.23,72.07 22.86,72.71 | 22.86,72.71 C16.2 | IC1.11 52.39,90.17 51.91,89.69 51.12,89.69 50.64,90.17 50.64,92.23 51.12,92.71 52.86,92.71 53.34,93.19 55.4,93.19 55.78,93.56 C4.2 55.88,94.24 v55.88,95.41 | 50.64,65.72 50.96,66.04 52.7,66.04 53.18,66.52 55.4,66.52 55.88,66.99 55.88,67.37 C17.2 55.88,67.57 v55.88,68.74 | 50.64,65.72 | 50.64,65.72 50.64,63.66 51.12,63.18 52.23,63.18 52.55,63.5 IC4.11 | 22.86,72.71 23.18,72.39 v23.18,71.44 | v10.79,53.02 11.75,52.07 13.02,52.07 13.34,51.75 13.34,51.22 R60.1 14.5,51.12 C25.1 | 19.37,36.2 v19.68,36.51 19.05,35.88 19.05,35.34 C33.2 19.15,32.6 20,31.75 IC9.11 | C47.2 19.05,4.55 | IC10.9 22.23,18.73 22.86,19.37 C41.2 23.18,19.27 v23.18,17.78 | 2.54,17.46 v3.17,17.46 | v19.05,56.52 19.05,57.68 C22.2 19.15,58.16 19.05,58.26 19.05,59.69 18.73,60.01 18.73,60.64 19.37,61.28 IC5.11 | C47.2 19.05,4.34 v19.05,3.17 | v55.88,42.07 55.88,40.9 C29.2 55.78,40.38 55.24,39.85 55.09,39.85 | 55.09,39.85 53.18,39.85 52.7,39.37 51.12,39.37 50.64,38.89 50.64,36.67 51.12,36.2 51.75,36.2 52.39,36.83 IC8.11 | 55.09,39.85 | IC11.11 53.02,10.16 52.7,10.48 52.7,12.7 54.08,14.07 C42.2 54.08,15.66 v55.24,16.83 | v19.68,89.85 19.15,89.32 C8.2 19.15,85.78 19.84,85.09 IC2.11 | IC12.11 19.37,7.94 18.73,7.3 18.73,6.03 19.15,5.61 C47.2
  Top 0.406: 2.54,71.12 2.54,67.31 2.22,66.99 2.22,65.72 2.54,65.41 2.54,55.88 2.86,55.56 v2.86,53.98 2.86,51.12 2.54,50.8 2.54,40.64 2.22,40.32 2.22,38.58 v2.86,37.94 2.86,36.51 2.54,36.2 2.54,17.46 2.54,13.97 2.22,13.65 2.22,12.38 3.49,11.11 v3.49,3.17 | 2.54,71.12 v3.17,71.12 | 2.54,71.12 2.54,89.53 2.86,89.85 v2.86,91.28 2.22,91.92 2.22,93.98 6.35,98.11 30.48,98.11 30.8,98.42 30.8,99.06 | 30.8,99.06 L2.1 | 30.8,99.06 30.8,99.69 | 30.8,99.69 C1.- | 30.8,99.69 32.07,99.69 33.34,100.97 D1.A 35.88,100.97 37.62,102.71 v55.88,102.71
  Bottom 0.254: 18.26,91.28 v19.68,89.85 | v23.18,71.44 22.86,71.12 v3.17,71.12 | v19.05,56.52 16.83,54.29 10.79,54.29 | v2.86,53.98 3.17,54.29 10.79,54.29 | 10.79,54.29 v10.79,53.02 | v23.18,17.78 22.86,17.46 v3.17,17.46 | v19.05,3.17 17.46,1.59 6.35,1.59 4.76,3.17 v3.49,3.17 | 18.26,91.28 | v2.86,91.28 18.26,91.28 | v19.68,36.51 18.26,37.94 v2.86,37.94
  Bottom 0.406: v55.88,102.71 v55.88,95.41 v55.88,68.74 v55.88,42.07 55.88,17.46 v55.24,16.83

### Text on the board
bPlace: stripe | Red
tNames: Blinds | cc-by-sa Émilie Gillet, | 2015. v6
bNames: +12V | GND | -12V | Blinds | cc-by-sa Émilie Gillet, | 2015. v6